# Altium project RK3566.PrjPcb (part 2 of 3)

## Sheet RK3566_POWER.SchDoc
size A3; SheetNumber: 15; SheetTotal: 20
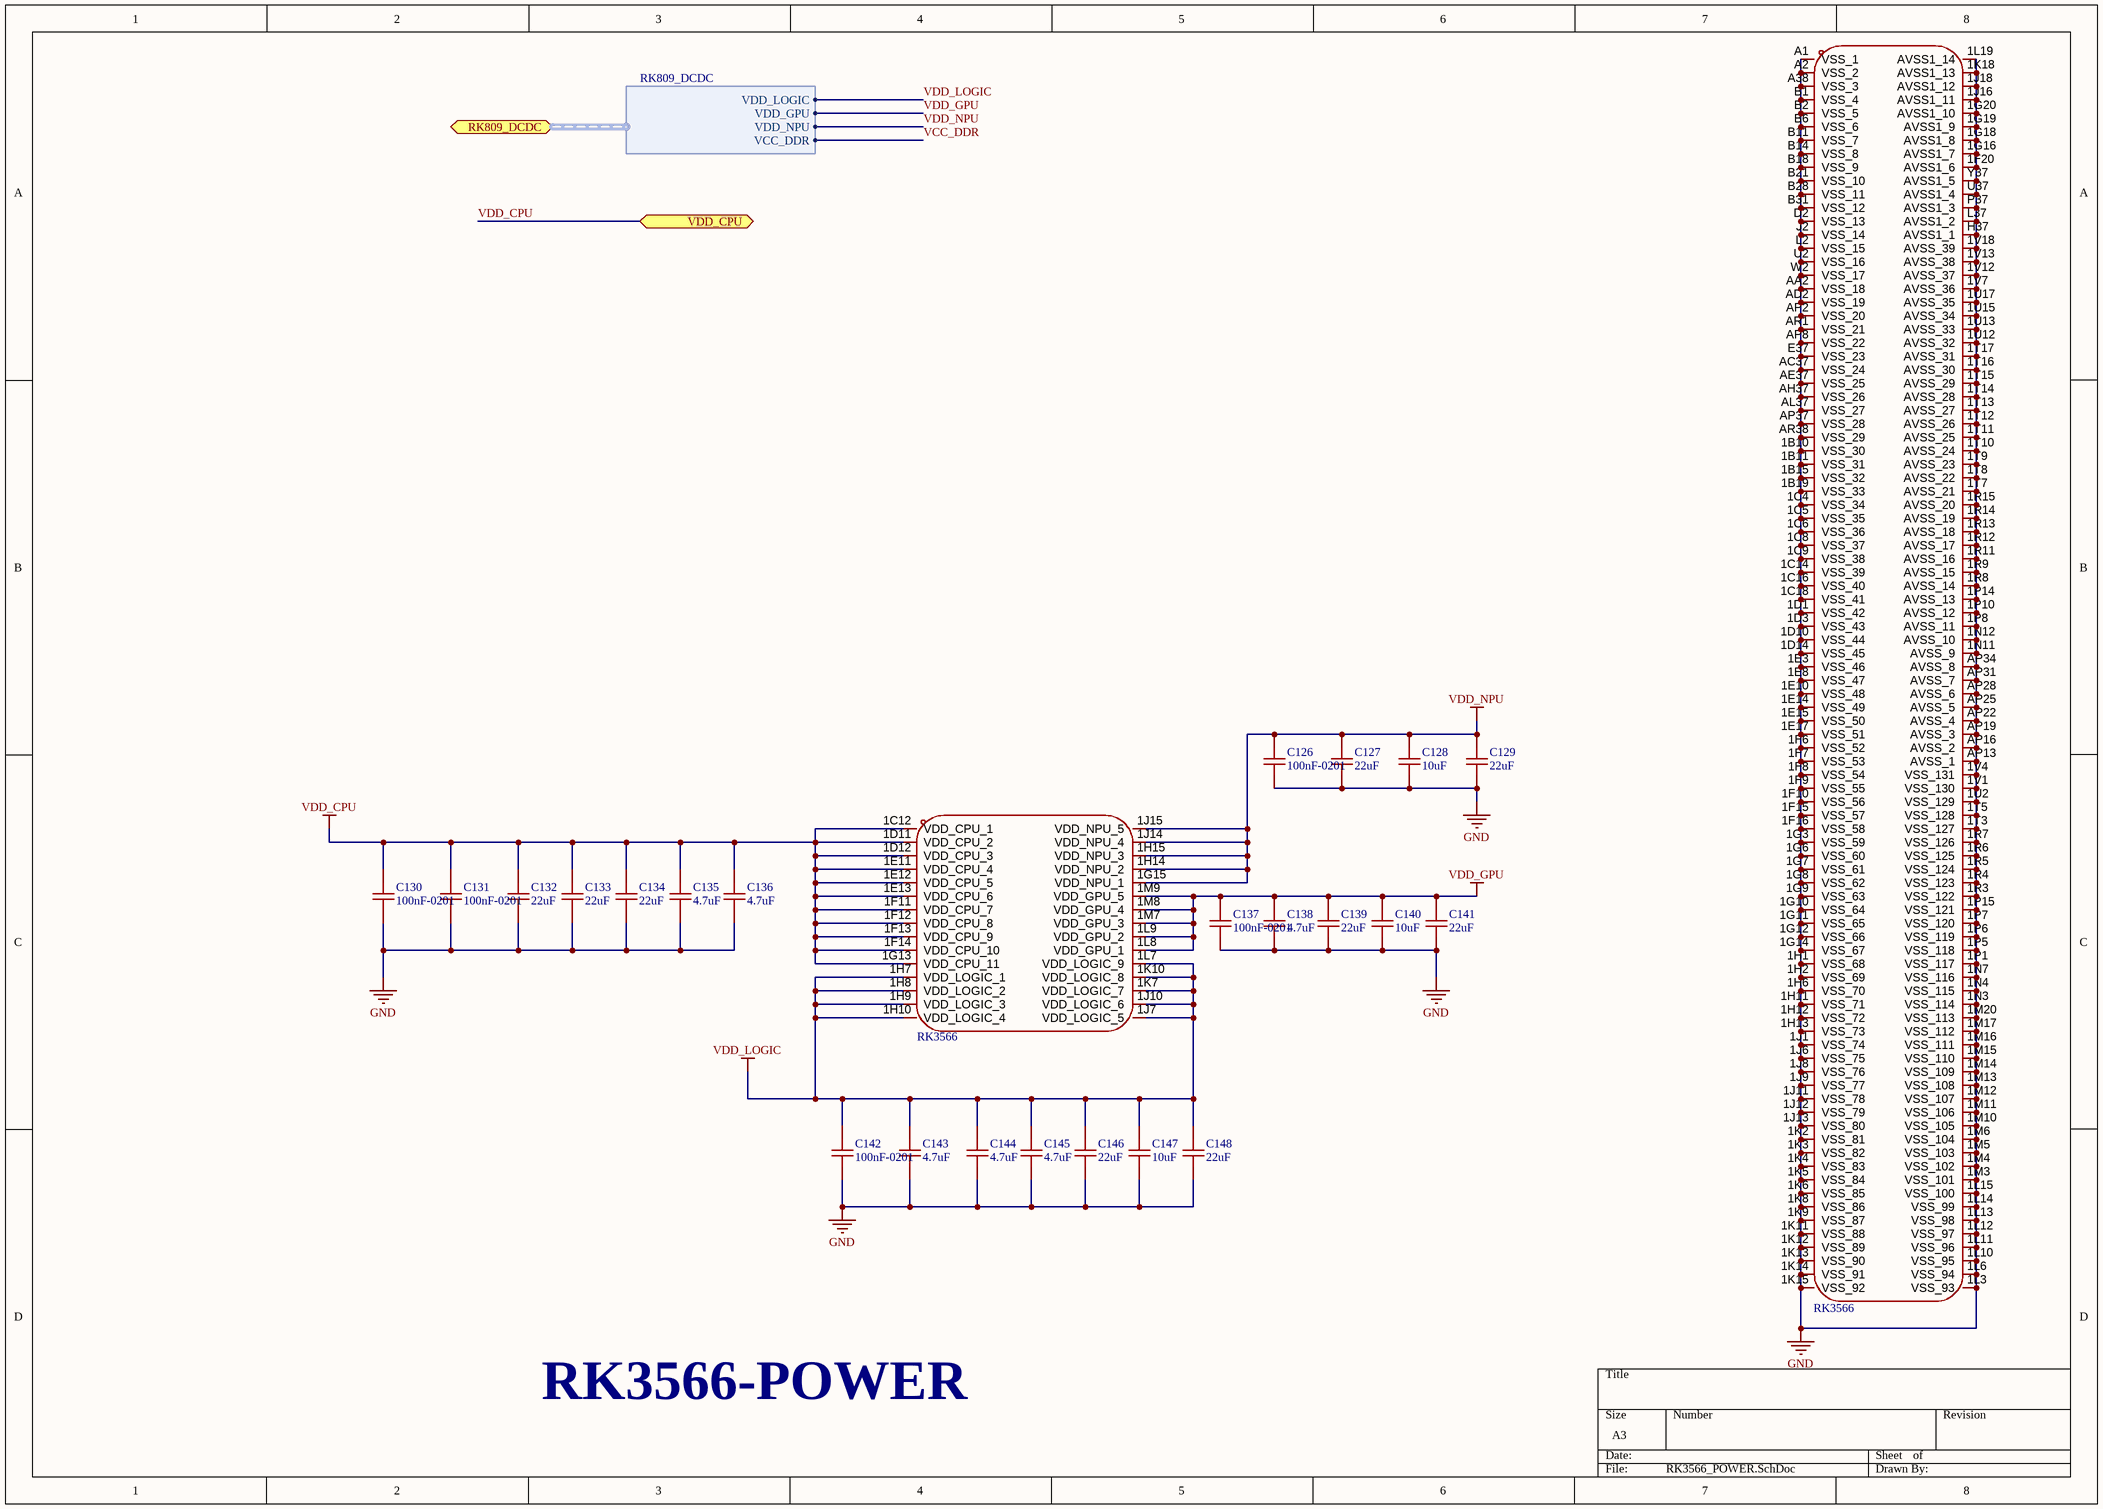
[diagram p7: RK3566_POWER.SchDoc]

### Parts
C126  100nF-0201  [C0201]
C127  22uF  [C0603]
C128  10uF  [C0603]
C129  22uF  [C0603]
C130  100nF-0201  [C0201]
C131  100nF-0201  [C0201]
C132  22uF  [C0603]
C133  22uF  [C0603]
C134  22uF  [C0603]
C135  4.7uF  [C0402]
C136  4.7uF  [C0402]
C137  100nF-0201  [C0201]
C138  4.7uF  [C0402]
C139  22uF  [C0603]
C140  10uF  [C0603]
C141  22uF  [C0603]
C142  100nF-0201  [C0201]
C143  4.7uF  [C0402]
C144  4.7uF  [C0402]
C145  4.7uF  [C0402]
C146  22uF  [C0603]
C147  10uF  [C0603]
C148  22uF  [C0603]
U2  RK3566  [BGA-565_L15.5-W14.4-P0.40_RK3566_1]  (parts A,B of 8)

### Ports
RK809_DCDC (bidir, harness RK809_DCDC, see RK3566[2D], POWER[3D], POWER_PMIC[1A], RK3566[3D]), VDD_CPU (bidir, see RK3566[2D], POWER[5D], POWER_EXTENSION[1A], RK3566[3D])

### Harnesses
RK809_DCDC: VDD_LOGIC, VDD_GPU, VDD_NPU, VCC_DDR

### Nets
GND: C126.1 C127.1 C128.1 C129.1 C130.1 C131.1 C132.1 C133.1 C134.1 C135.1 C136.1 C137.1 C138.1 C139.1 C140.1 C141.1 C142.1 C143.1 C144.1 C145.1 C146.1 C147.1 C148.1 U2.1B10(VSS_30) U2.1B11(VSS_31) U2.1B15(VSS_32) U2.1B19(VSS_33) U2.1C4(VSS_34) U2.1C5(VSS_35) U2.1C6(VSS_36) U2.1C8(VSS_37) U2.1C9(VSS_38) U2.1C14(VSS_39) U2.1C16(VSS_40) U2.1C18(VSS_41) U2.1D1(VSS_42) U2.1D3(VSS_43) U2.1D10(VSS_44) U2.1D14(VSS_45) U2.1E3(VSS_46) U2.1E8(VSS_47) U2.1E10(VSS_48) U2.1E14(VSS_49) U2.1E15(VSS_50) U2.1E17(VSS_51) U2.1F6(VSS_52) U2.1F7(VSS_53) U2.1F8(VSS_54) U2.1F9(VSS_55) U2.1F10(VSS_56) U2.1F15(VSS_57) U2.1F16(VSS_58) U2.1F20(AVSS1_6) U2.1G3(VSS_59) U2.1G6(VSS_60) U2.1G7(VSS_61) U2.1G8(VSS_62) U2.1G9(VSS_63) U2.1G10(VSS_64) U2.1G11(VSS_65) U2.1G12(VSS_66) U2.1G14(VSS_67) U2.1G16(AVSS1_7) U2.1G18(AVSS1_8) U2.1G19(AVSS1_9) U2.1G20(AVSS1_10) U2.1H1(VSS_68) U2.1H2(VSS_69) U2.1H6(VSS_70) U2.1H11(VSS_71) U2.1H12(VSS_72) U2.1H13(VSS_73) U2.1J1(VSS_74) U2.1J6(VSS_75) U2.1J8(VSS_76) U2.1J9(VSS_77) U2.1J11(VSS_78) U2.1J12(VSS_79) U2.1J13(VSS_80) U2.1J16(AVSS1_11) U2.1J18(AVSS1_12) U2.1K2(VSS_81) U2.1K3(VSS_82) U2.1K4(VSS_83) U2.1K5(VSS_84) U2.1K6(VSS_85) U2.1K8(VSS_86) U2.1K9(VSS_87) U2.1K11(VSS_88) U2.1K12(VSS_89) U2.1K13(VSS_90) U2.1K14(VSS_91) U2.1K15(VSS_92) U2.1K18(AVSS1_13) U2.1L3(VSS_93) U2.1L6(VSS_94) U2.1L10(VSS_95) U2.1L11(VSS_96) U2.1L12(VSS_97) U2.1L13(VSS_98) U2.1L14(VSS_99) U2.1L15(VSS_100) U2.1L19(AVSS1_14) U2.1M3(VSS_101) U2.1M4(VSS_102) U2.1M5(VSS_103) U2.1M6(VSS_104) U2.1M10(VSS_105) U2.1M11(VSS_106) U2.1M12(VSS_107) U2.1M13(VSS_108) U2.1M14(VSS_109) U2.1M15(VSS_110) U2.1M16(VSS_111) U2.1M17(VSS_112) U2.1M20(VSS_113) U2.1N3(VSS_114) U2.1N4(VSS_115) U2.1N7(VSS_116) U2.1N11(AVSS_9) U2.1N12(AVSS_10) U2.1P1(VSS_117) U2.1P5(VSS_118) U2.1P6(VSS_119) U2.1P7(VSS_120) U2.1P8(AVSS_11) U2.1P10(AVSS_12) U2.1P14(AVSS_13) U2.1P15(VSS_121) U2.1R3(VSS_122) U2.1R4(VSS_123) U2.1R5(VSS_124) U2.1R6(VSS_125) U2.1R7(VSS_126) U2.1R8(AVSS_14) U2.1R9(AVSS_15) U2.1R11(AVSS_16) U2.1R12(AVSS_17) U2.1R13(AVSS_18) U2.1R14(AVSS_19) U2.1R15(AVSS_20) U2.1T3(VSS_127) U2.1T5(VSS_128) U2.1T7(AVSS_21) U2.1T8(AVSS_22) U2.1T9(AVSS_23) U2.1T10(AVSS_24) U2.1T11(AVSS_25) U2.1T12(AVSS_26) U2.1T13(AVSS_27) U2.1T14(AVSS_28) U2.1T15(AVSS_29) U2.1T16(AVSS_30) U2.1T17(AVSS_31) U2.1U2(VSS_129) U2.1U12(AVSS_32) U2.1U13(AVSS_33) U2.1U15(AVSS_34) U2.1U17(AVSS_35) U2.1V1(VSS_130) U2.1V4(VSS_131) U2.1V7(AVSS_36) U2.1V12(AVSS_37) U2.1V13(AVSS_38) U2.1V18(AVSS_39) U2.A1(VSS_1) U2.A2(VSS_2) U2.A38(VSS_3) U2.AA2(VSS_18) U2.AC37(VSS_24) U2.AD2(VSS_19) U2.AE37(VSS_25) U2.AH37(VSS_26) U2.AL37(VSS_27) U2.AP2(VSS_20) U2.AP8(VSS_22) U2.AP13(AVSS_1) U2.AP16(AVSS_2) U2.AP19(AVSS_3) U2.AP22(AVSS_4) U2.AP25(AVSS_5) U2.AP28(AVSS_6) U2.AP31(AVSS_7) U2.AP34(AVSS_8) U2.AP37(VSS_28) U2.AR1(VSS_21) U2.AR38(VSS_29) U2.B1(VSS_4) U2.B2(VSS_5) U2.B6(VSS_6) U2.B11(VSS_7) U2.B14(VSS_8) U2.B18(VSS_9) U2.B21(VSS_10) U2.B28(VSS_11) U2.B31(VSS_12) U2.D2(VSS_13) U2.E37(VSS_23) U2.H37(AVSS1_1) U2.J2(VSS_14) U2.L2(VSS_15) U2.L37(AVSS1_2) U2.P37(AVSS1_3) U2.U2(VSS_16) U2.U37(AVSS1_4) U2.W2(VSS_17) U2.Y37(AVSS1_5)
VDD_CPU: C130.2 C131.2 C132.2 C133.2 C134.2 C135.2 C136.2 U2.1C12(VDD_CPU_1) U2.1D11(VDD_CPU_2) U2.1D12(VDD_CPU_3) U2.1E11(VDD_CPU_4) U2.1E12(VDD_CPU_5) U2.1E13(VDD_CPU_6) U2.1F11(VDD_CPU_7) U2.1F12(VDD_CPU_8) U2.1F13(VDD_CPU_9) U2.1F14(VDD_CPU_10) U2.1G13(VDD_CPU_11) ; port VDD_CPU
VDD_GPU: C137.2 C138.2 C139.2 C140.2 C141.2 U2.1L8(VDD_GPU_1) U2.1L9(VDD_GPU_2) U2.1M7(VDD_GPU_3) U2.1M8(VDD_GPU_4) U2.1M9(VDD_GPU_5) ; port RK809_DCDC.VDD_GPU
VDD_LOGIC: C142.2 C143.2 C144.2 C145.2 C146.2 C147.2 C148.2 U2.1H7(VDD_LOGIC_1) U2.1H8(VDD_LOGIC_2) U2.1H9(VDD_LOGIC_3) U2.1H10(VDD_LOGIC_4) U2.1J7(VDD_LOGIC_5) U2.1J10(VDD_LOGIC_6) U2.1K7(VDD_LOGIC_7) U2.1K10(VDD_LOGIC_8) U2.1L7(VDD_LOGIC_9) ; port RK809_DCDC.VDD_LOGIC
VDD_NPU: C126.2 C127.2 C128.2 C129.2 U2.1G15(VDD_NPU_1) U2.1H14(VDD_NPU_2) U2.1H15(VDD_NPU_3) U2.1J14(VDD_NPU_4) U2.1J15(VDD_NPU_5) ; port RK809_DCDC.VDD_NPU

### Notes on the sheet
- RK3566-POWER

### Library data of the parts
C126 C130 C131 C137 C142 = 100nF-0201: CL03A104KO3NNNC
C127 C129 C132-C134 C139 C141 C146 C148 = 22uF: 16V 22uF X5R ±20% 0603 Ceramic Capacitors ROHS
C128 C140 C147 = 10uF: 10V 10uF X5R ±10% 0603 Ceramic Capacitors ROHS
C135 C136 C138 C143-C145 = 4.7uF: 10V 4.7uF X5R ±20% 0402 Ceramic Capacitors ROHS
U2 = RK3566: BGA-565(15.5x14.4); Symbol: RK3566

## Sheet LPDDR4.SchDoc
size A3; SheetNumber: 3; SheetTotal: 20
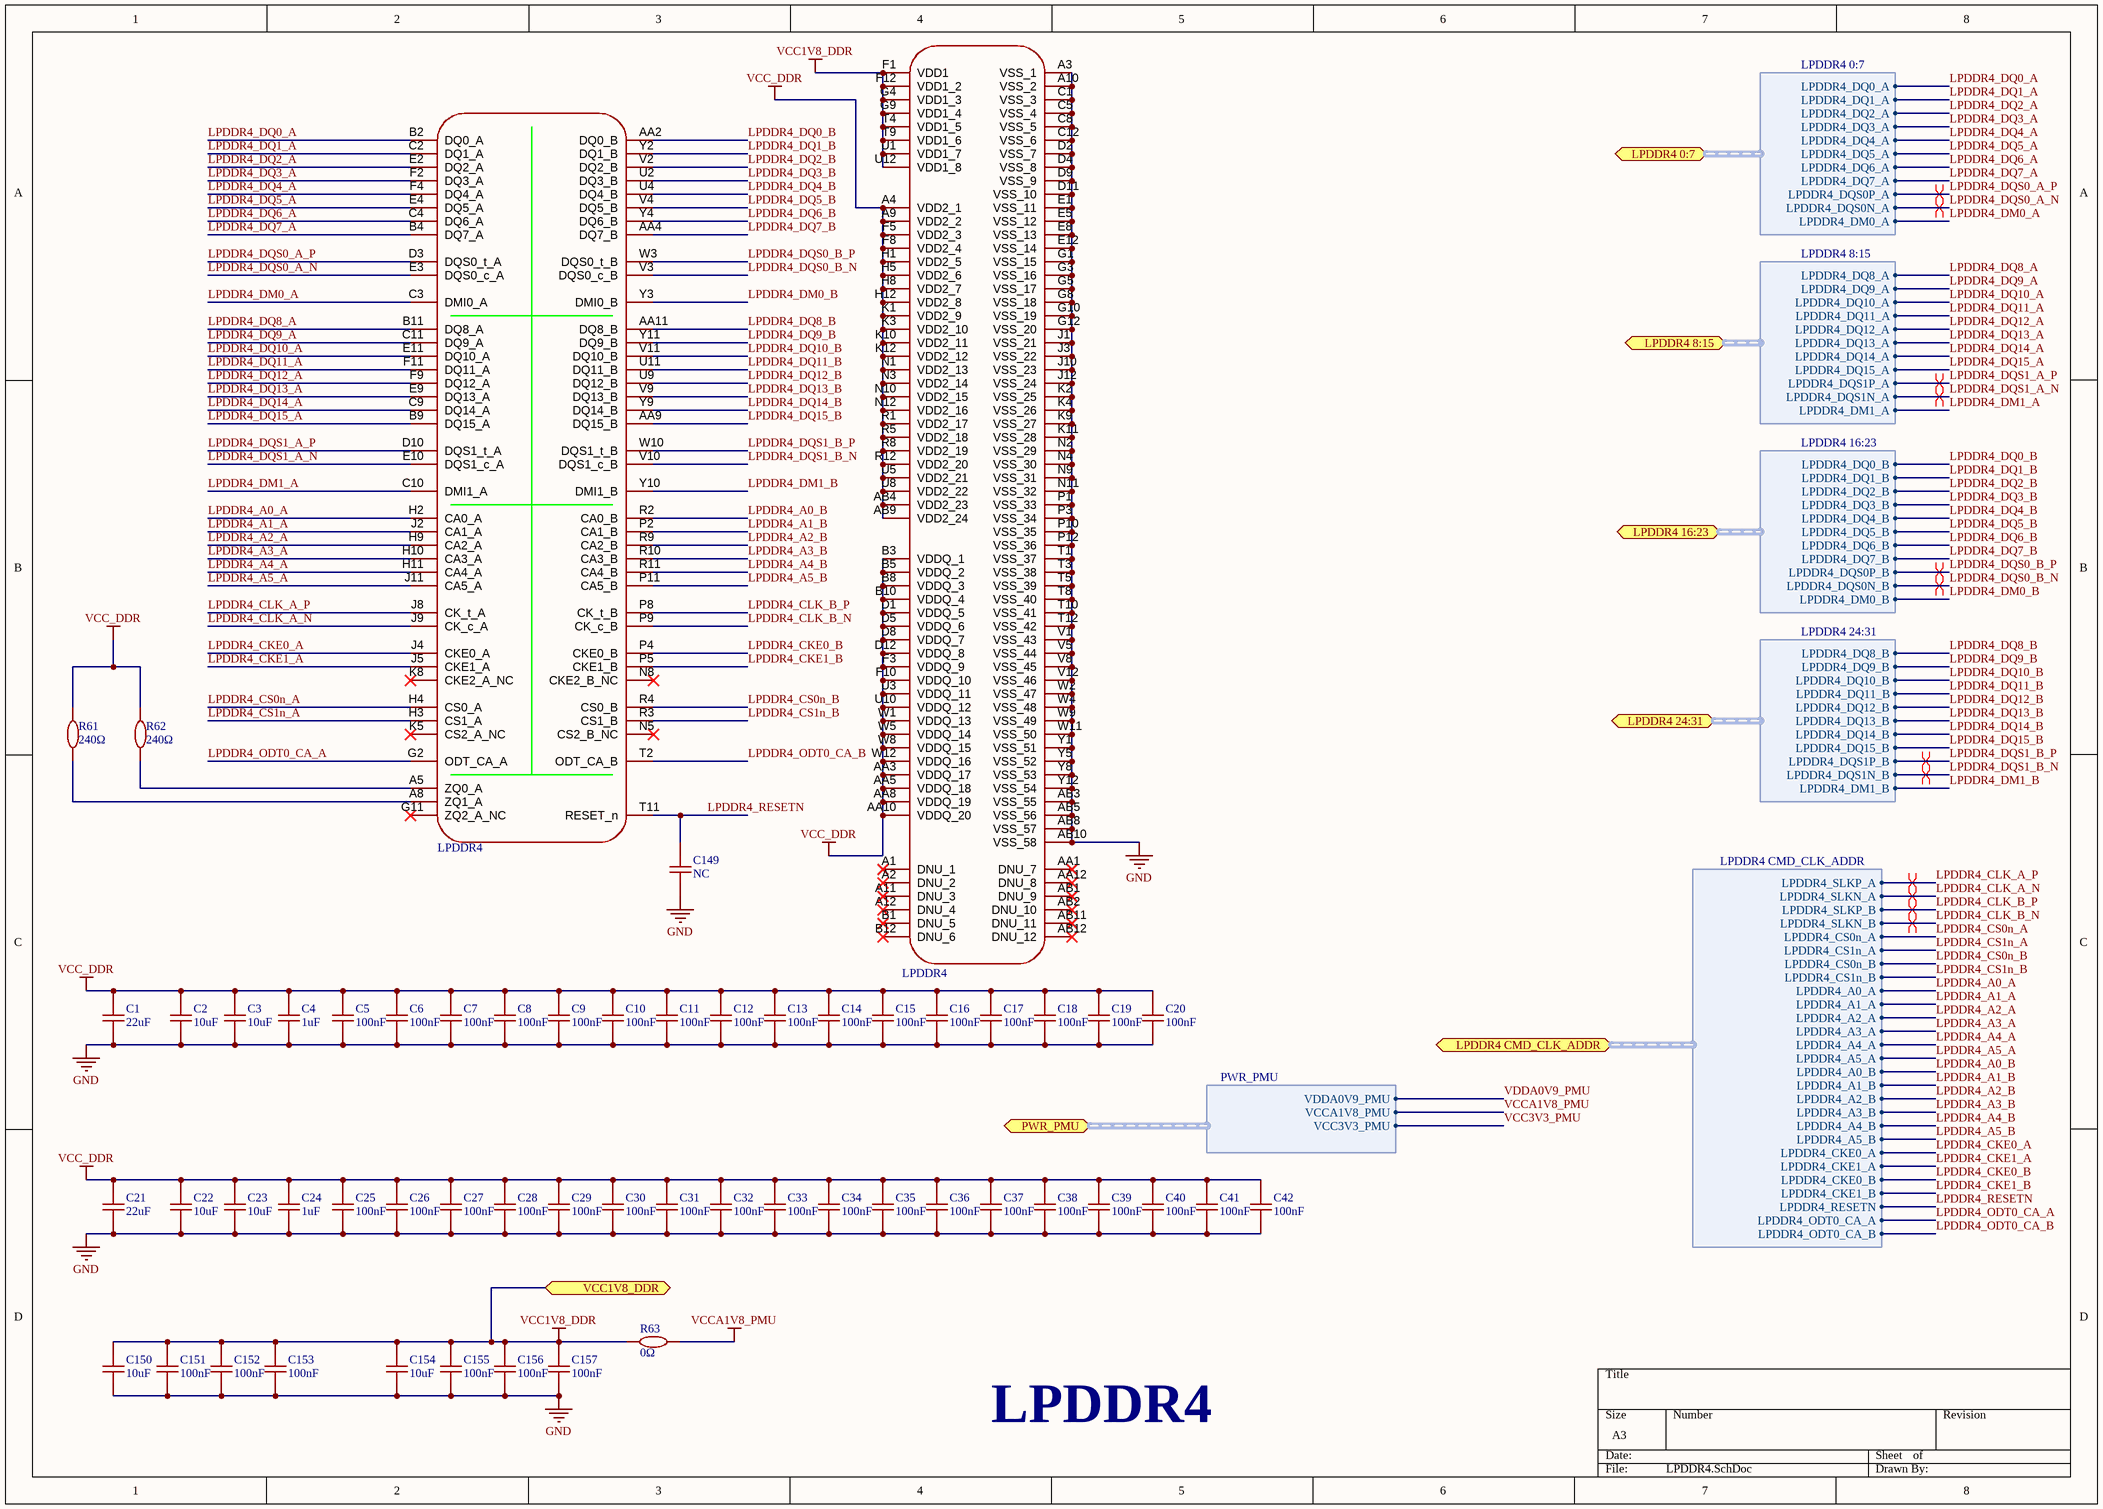
[diagram p8: LPDDR4.SchDoc]

### Parts
C1  22uF  [C0603]
C2  10uF  [C0603]
C3  10uF  [C0603]
C4  1uF  [C0402]
C5  100nF  [C0402]
C6  100nF  [C0402]
C7  100nF  [C0402]
C8  100nF  [C0402]
C9  100nF  [C0402]
C10  100nF  [C0402]
C11  100nF  [C0402]
C12  100nF  [C0402]
C13  100nF  [C0402]
C14  100nF  [C0402]
C15  100nF  [C0402]
C16  100nF  [C0402]
C17  100nF  [C0402]
C18  100nF  [C0402]
C19  100nF  [C0402]
C20  100nF  [C0402]
C21  22uF  [C0603]
C22  10uF  [C0603]
C23  10uF  [C0603]
C24  1uF  [C0402]
C25  100nF  [C0402]
C26  100nF  [C0402]
C27  100nF  [C0402]
C28  100nF  [C0402]
C29  100nF  [C0402]
C30  100nF  [C0402]
C31  100nF  [C0402]
C32  100nF  [C0402]
C33  100nF  [C0402]
C34  100nF  [C0402]
C35  100nF  [C0402]
C36  100nF  [C0402]
C37  100nF  [C0402]
C38  100nF  [C0402]
C39  100nF  [C0402]
C40  100nF  [C0402]
C41  100nF  [C0402]
C42  100nF  [C0402]
C149  NC  [C0402]
C150  10uF  [C0603]
C151  100nF  [C0402]
C152  100nF  [C0402]
C153  100nF  [C0402]
C154  10uF  [C0603]
C155  100nF  [C0402]
C156  100nF  [C0402]
C157  100nF  [C0402]
R61  240Ω  [R0402]
R62  240Ω  [R0402]
R63  0Ω  [R0402]
U1  LPDDR4  [FBGA-200_L15.0-W10.0-BL_H9HCNNNBKUMLXR]  (parts A,B of 2)

### Ports
LPDDR4 0:7 (bidir, harness LPDDR4 0:7, see Overview[6B], RK3566[2A], RK3566_DDR_PHY[3@]), LPDDR4 8:15 (bidir, harness LPDDR4 8:15, see Overview[6B], RK3566[2A], RK3566_DDR_PHY[3@]), LPDDR4 16:23 (bidir, harness LPDDR4 16:23, see Overview[6B], RK3566[2A], RK3566_DDR_PHY[3A]), LPDDR4 24:31 (bidir, harness LPDDR4 24:31, see Overview[6B], RK3566[2A], RK3566_DDR_PHY[3B]), LPDDR4 CMD_CLK_ADDR (bidir, harness LPDDR4 CMD_CLK_ADDR, see Overview[6B], RK3566[2A], RK3566_DDR_PHY[3C]), PWR_PMU (bidir, harness PWR_PMU, see Overview[7B], POWER[2D], POWER_PMIC[4D], RK3566[3C], RK3566_OSC_PLL_PMUO1_2[1A]), VCC1V8_DDR (bidir)

### Harnesses
LPDDR4 0:7: LPDDR4_DQ0_A, LPDDR4_DQ1_A, LPDDR4_DQ2_A, LPDDR4_DQ3_A, LPDDR4_DQ4_A, LPDDR4_DQ5_A, LPDDR4_DQ6_A, LPDDR4_DQ7_A, LPDDR4_DQS0P_A, LPDDR4_DQS0N_A, LPDDR4_DM0_A
LPDDR4 8:15: LPDDR4_DQ8_A, LPDDR4_DQ9_A, LPDDR4_DQ10_A, LPDDR4_DQ11_A, LPDDR4_DQ12_A, LPDDR4_DQ13_A, LPDDR4_DQ14_A, LPDDR4_DQ15_A, LPDDR4_DQS1P_A, LPDDR4_DQS1N_A, LPDDR4_DM1_A
LPDDR4 16:23: LPDDR4_DQ0_B, LPDDR4_DQ1_B, LPDDR4_DQ2_B, LPDDR4_DQ3_B, LPDDR4_DQ4_B, LPDDR4_DQ5_B, LPDDR4_DQ6_B, LPDDR4_DQ7_B, LPDDR4_DQS0P_B, LPDDR4_DQS0N_B, LPDDR4_DM0_B
LPDDR4 24:31: LPDDR4_DQ8_B, LPDDR4_DQ9_B, LPDDR4_DQ10_B, LPDDR4_DQ11_B, LPDDR4_DQ12_B, LPDDR4_DQ13_B, LPDDR4_DQ14_B, LPDDR4_DQ15_B, LPDDR4_DQS1P_B, LPDDR4_DQS1N_B, LPDDR4_DM1_B
LPDDR4 CMD_CLK_ADDR: LPDDR4_SLKP_A, LPDDR4_SLKN_A, LPDDR4_SLKP_B, LPDDR4_SLKN_B, LPDDR4_CS0n_A, LPDDR4_CS1n_A, LPDDR4_CS0n_B, LPDDR4_CS1n_B, LPDDR4_A0_A, LPDDR4_A1_A, LPDDR4_A2_A, LPDDR4_A3_A, LPDDR4_A4_A, LPDDR4_A5_A, LPDDR4_A0_B, LPDDR4_A1_B, LPDDR4_A2_B, LPDDR4_A3_B, LPDDR4_A4_B, LPDDR4_A5_B, LPDDR4_CKE0_A, LPDDR4_CKE1_A, LPDDR4_CKE0_B, LPDDR4_CKE1_B, LPDDR4_RESETN, LPDDR4_ODT0_CA_A, LPDDR4_ODT0_CA_B
PWR_PMU: VCCA1V8_PMU, VDDA0V9_PMU, VCC3V3_PMU

### Nets
GND: C1.1 C2.1 C3.1 C4.1 C5.1 C6.1 C7.1 C8.1 C9.1 C10.1 C11.1 C12.1 C13.1 C14.1 C15.1 C16.1 C17.1 C18.1 C19.1 C20.1 C21.1 C22.1 C23.1 C24.1 C25.1 C26.1 C27.1 C28.1 C29.1 C30.1 C31.1 C32.1 C33.1 C34.1 C35.1 C36.1 C37.1 C38.1 C39.1 C40.1 C41.1 C42.1 C149.1 C150.1 C151.1 C152.1 C153.1 C154.1 C155.1 C156.1 C157.1 U1.A3(VSS_1) U1.A10(VSS_2) U1.AB3(VSS_55) U1.AB5(VSS_56) U1.AB8(VSS_57) U1.AB10(VSS_58) U1.C1(VSS_3) U1.C5(VSS_4) U1.C8(VSS_5) U1.C12(VSS_6) U1.D2(VSS_7) U1.D4(VSS_8) U1.D9(VSS_9) U1.D11(VSS_10) U1.E1(VSS_11) U1.E5(VSS_12) U1.E8(VSS_13) U1.E12(VSS_14) U1.G1(VSS_15) U1.G3(VSS_16) U1.G5(VSS_17) U1.G8(VSS_18) U1.G10(VSS_19) U1.G12(VSS_20) U1.J1(VSS_21) U1.J3(VSS_22) U1.J10(VSS_23) U1.J12(VSS_24) U1.K2(VSS_25) U1.K4(VSS_26) U1.K9(VSS_27) U1.K11(VSS_28) U1.N2(VSS_29) U1.N4(VSS_30) U1.N9(VSS_31) U1.N11(VSS_32) U1.P1(VSS_33) U1.P3(VSS_34) U1.P10(VSS_35) U1.P12(VSS_36) U1.T1(VSS_37) U1.T3(VSS_38) U1.T5(VSS_39) U1.T8(VSS_40) U1.T10(VSS_41) U1.T12(VSS_42) U1.V1(VSS_43) U1.V5(VSS_44) U1.V8(VSS_45) U1.V12(VSS_46) U1.W2(VSS_47) U1.W4(VSS_48) U1.W9(VSS_49) U1.W11(VSS_50) U1.Y1(VSS_51) U1.Y5(VSS_52) U1.Y8(VSS_53) U1.Y12(VSS_54)
VCC1V8_DDR: C150.2 C151.2 C152.2 C153.2 C154.2 C155.2 C156.2 C157.2 R63.1 U1.F1(VDD1) U1.F12(VDD1_2) U1.G4(VDD1_3) U1.G9(VDD1_4) U1.T4(VDD1_5) U1.T9(VDD1_6) U1.U1(VDD1_7) U1.U12(VDD1_8) ; port VCC1V8_DDR
VCC_DDR: C1.2 C2.2 C3.2 C4.2 C5.2 C6.2 C7.2 C8.2 C9.2 C10.2 C11.2 C12.2 C13.2 C14.2 C15.2 C16.2 C17.2 C18.2 C19.2 C20.2 C21.2 C22.2 C23.2 C24.2 C25.2 C26.2 C27.2 C28.2 C29.2 C30.2 C31.2 C32.2 C33.2 C34.2 C35.2 C36.2 C37.2 C38.2 C39.2 C40.2 C41.2 C42.2 R61.2 R62.2 U1.A4(VDD2_1) U1.A9(VDD2_2) U1.AA3(VDDQ_17) U1.AA5(VDDQ_18) U1.AA8(VDDQ_19) U1.AA10(VDDQ_20) U1.AB4(VDD2_23) U1.AB9(VDD2_24) U1.B3(VDDQ_1) U1.B5(VDDQ_2) U1.B8(VDDQ_3) U1.B10(VDDQ_4) U1.D1(VDDQ_5) U1.D5(VDDQ_6) U1.D8(VDDQ_7) U1.D12(VDDQ_8) U1.F3(VDDQ_9) U1.F5(VDD2_3) U1.F8(VDD2_4) U1.F10(VDDQ_10) U1.H1(VDD2_5) U1.H5(VDD2_6) U1.H8(VDD2_7) U1.H12(VDD2_8) U1.K1(VDD2_9) U1.K3(VDD2_10) U1.K10(VDD2_11) U1.K12(VDD2_12) U1.N1(VDD2_13) U1.N3(VDD2_14) U1.N10(VDD2_15) U1.N12(VDD2_16) U1.R1(VDD2_17) U1.R5(VDD2_18) U1.R8(VDD2_19) U1.R12(VDD2_20) U1.U3(VDDQ_11) U1.U5(VDD2_21) U1.U8(VDD2_22) U1.U10(VDDQ_12) U1.W1(VDDQ_13) U1.W5(VDDQ_14) U1.W8(VDDQ_15) U1.W12(VDDQ_16)
VCCA1V8_PMU: R63.2 ; port PWR_PMU.VCCA1V8_PMU
LPDDR4_A0_A: U1.H2(CA0_A) ; port LPDDR4 CMD_CLK_ADDR.LPDDR4_A0_A
LPDDR4_A0_B: U1.R2(CA0_B) ; port LPDDR4 CMD_CLK_ADDR.LPDDR4_A0_B
LPDDR4_A1_A: U1.J2(CA1_A) ; port LPDDR4 CMD_CLK_ADDR.LPDDR4_A1_A
LPDDR4_A1_B: U1.P2(CA1_B) ; port LPDDR4 CMD_CLK_ADDR.LPDDR4_A1_B
LPDDR4_A2_A: U1.H9(CA2_A) ; port LPDDR4 CMD_CLK_ADDR.LPDDR4_A2_A
LPDDR4_A2_B: U1.R9(CA2_B) ; port LPDDR4 CMD_CLK_ADDR.LPDDR4_A2_B
LPDDR4_A3_A: U1.H10(CA3_A) ; port LPDDR4 CMD_CLK_ADDR.LPDDR4_A3_A
LPDDR4_A3_B: U1.R10(CA3_B) ; port LPDDR4 CMD_CLK_ADDR.LPDDR4_A3_B
LPDDR4_A4_A: U1.H11(CA4_A) ; port LPDDR4 CMD_CLK_ADDR.LPDDR4_A4_A
LPDDR4_A4_B: U1.R11(CA4_B) ; port LPDDR4 CMD_CLK_ADDR.LPDDR4_A4_B
LPDDR4_A5_A: U1.J11(CA5_A) ; port LPDDR4 CMD_CLK_ADDR.LPDDR4_A5_A
LPDDR4_A5_B: U1.P11(CA5_B) ; port LPDDR4 CMD_CLK_ADDR.LPDDR4_A5_B
LPDDR4_CKE0_A: U1.J4(CKE0_A) ; port LPDDR4 CMD_CLK_ADDR.LPDDR4_CKE0_A
LPDDR4_CKE0_B: U1.P4(CKE0_B) ; port LPDDR4 CMD_CLK_ADDR.LPDDR4_CKE0_B
LPDDR4_CKE1_A: U1.J5(CKE1_A) ; port LPDDR4 CMD_CLK_ADDR.LPDDR4_CKE1_A
LPDDR4_CKE1_B: U1.P5(CKE1_B) ; port LPDDR4 CMD_CLK_ADDR.LPDDR4_CKE1_B
LPDDR4_CLK_A_N: U1.J9(CK_c_A) ; port LPDDR4 CMD_CLK_ADDR.LPDDR4_SLKN_A
LPDDR4_CLK_A_P: U1.J8(CK_t_A) ; port LPDDR4 CMD_CLK_ADDR.LPDDR4_SLKP_A
LPDDR4_CLK_B_N: U1.P9(CK_c_B) ; port LPDDR4 CMD_CLK_ADDR.LPDDR4_SLKN_B
LPDDR4_CLK_B_P: U1.P8(CK_t_B) ; port LPDDR4 CMD_CLK_ADDR.LPDDR4_SLKP_B
LPDDR4_CS0n_A: U1.H4(CS0_A) ; port LPDDR4 CMD_CLK_ADDR.LPDDR4_CS0n_A
LPDDR4_CS0n_B: U1.R4(CS0_B) ; port LPDDR4 CMD_CLK_ADDR.LPDDR4_CS0n_B
LPDDR4_CS1n_A: U1.H3(CS1_A) ; port LPDDR4 CMD_CLK_ADDR.LPDDR4_CS1n_A
LPDDR4_CS1n_B: U1.R3(CS1_B) ; port LPDDR4 CMD_CLK_ADDR.LPDDR4_CS1n_B
LPDDR4_DM0_A: U1.C3(DMI0_A) ; port LPDDR4 0:7.LPDDR4_DM0_A
LPDDR4_DM0_B: U1.Y3(DMI0_B) ; port LPDDR4 16:23.LPDDR4_DM0_B
LPDDR4_DM1_A: U1.C10(DMI1_A) ; port LPDDR4 8:15.LPDDR4_DM1_A
LPDDR4_DM1_B: U1.Y10(DMI1_B) ; port LPDDR4 24:31.LPDDR4_DM1_B
LPDDR4_DQ0_A: U1.B2(DQ0_A) ; port LPDDR4 0:7.LPDDR4_DQ0_A
LPDDR4_DQ0_B: U1.AA2(DQ0_B) ; port LPDDR4 16:23.LPDDR4_DQ0_B
LPDDR4_DQ1_A: U1.C2(DQ1_A) ; port LPDDR4 0:7.LPDDR4_DQ1_A
LPDDR4_DQ1_B: U1.Y2(DQ1_B) ; port LPDDR4 16:23.LPDDR4_DQ1_B
LPDDR4_DQ2_A: U1.E2(DQ2_A) ; port LPDDR4 0:7.LPDDR4_DQ2_A
LPDDR4_DQ2_B: U1.V2(DQ2_B) ; port LPDDR4 16:23.LPDDR4_DQ2_B
LPDDR4_DQ3_A: U1.F2(DQ3_A) ; port LPDDR4 0:7.LPDDR4_DQ3_A
LPDDR4_DQ3_B: U1.U2(DQ3_B) ; port LPDDR4 16:23.LPDDR4_DQ3_B
LPDDR4_DQ4_A: U1.F4(DQ4_A) ; port LPDDR4 0:7.LPDDR4_DQ4_A
LPDDR4_DQ4_B: U1.U4(DQ4_B) ; port LPDDR4 16:23.LPDDR4_DQ4_B
LPDDR4_DQ5_A: U1.E4(DQ5_A) ; port LPDDR4 0:7.LPDDR4_DQ5_A
LPDDR4_DQ5_B: U1.V4(DQ5_B) ; port LPDDR4 16:23.LPDDR4_DQ5_B
LPDDR4_DQ6_A: U1.C4(DQ6_A) ; port LPDDR4 0:7.LPDDR4_DQ6_A
LPDDR4_DQ6_B: U1.Y4(DQ6_B) ; port LPDDR4 16:23.LPDDR4_DQ6_B
LPDDR4_DQ7_A: U1.B4(DQ7_A) ; port LPDDR4 0:7.LPDDR4_DQ7_A
LPDDR4_DQ7_B: U1.AA4(DQ7_B) ; port LPDDR4 16:23.LPDDR4_DQ7_B
LPDDR4_DQ8_A: U1.B11(DQ8_A) ; port LPDDR4 8:15.LPDDR4_DQ8_A
LPDDR4_DQ8_B: U1.AA11(DQ8_B) ; port LPDDR4 24:31.LPDDR4_DQ8_B
LPDDR4_DQ9_A: U1.C11(DQ9_A) ; port LPDDR4 8:15.LPDDR4_DQ9_A
LPDDR4_DQ9_B: U1.Y11(DQ9_B) ; port LPDDR4 24:31.LPDDR4_DQ9_B
LPDDR4_DQ10_A: U1.E11(DQ10_A) ; port LPDDR4 8:15.LPDDR4_DQ10_A
LPDDR4_DQ10_B: U1.V11(DQ10_B) ; port LPDDR4 24:31.LPDDR4_DQ10_B
LPDDR4_DQ11_A: U1.F11(DQ11_A) ; port LPDDR4 8:15.LPDDR4_DQ11_A
LPDDR4_DQ11_B: U1.U11(DQ11_B) ; port LPDDR4 24:31.LPDDR4_DQ11_B
LPDDR4_DQ12_A: U1.F9(DQ12_A) ; port LPDDR4 8:15.LPDDR4_DQ12_A
LPDDR4_DQ12_B: U1.U9(DQ12_B) ; port LPDDR4 24:31.LPDDR4_DQ12_B
LPDDR4_DQ13_A: U1.E9(DQ13_A) ; port LPDDR4 8:15.LPDDR4_DQ13_A
LPDDR4_DQ13_B: U1.V9(DQ13_B) ; port LPDDR4 24:31.LPDDR4_DQ13_B
LPDDR4_DQ14_A: U1.C9(DQ14_A) ; port LPDDR4 8:15.LPDDR4_DQ14_A
LPDDR4_DQ14_B: U1.Y9(DQ14_B) ; port LPDDR4 24:31.LPDDR4_DQ14_B
LPDDR4_DQ15_A: U1.B9(DQ15_A) ; port LPDDR4 8:15.LPDDR4_DQ15_A
LPDDR4_DQ15_B: U1.AA9(DQ15_B) ; port LPDDR4 24:31.LPDDR4_DQ15_B
LPDDR4_DQS0_A_N: U1.E3(DQS0_c_A) ; port LPDDR4 0:7.LPDDR4_DQS0N_A
LPDDR4_DQS0_A_P: U1.D3(DQS0_t_A) ; port LPDDR4 0:7.LPDDR4_DQS0P_A
LPDDR4_DQS0_B_N: U1.V3(DQS0_c_B) ; port LPDDR4 16:23.LPDDR4_DQS0N_B
LPDDR4_DQS0_B_P: U1.W3(DQS0_t_B) ; port LPDDR4 16:23.LPDDR4_DQS0P_B
LPDDR4_DQS1_A_N: U1.E10(DQS1_c_A) ; port LPDDR4 8:15.LPDDR4_DQS1N_A
LPDDR4_DQS1_A_P: U1.D10(DQS1_t_A) ; port LPDDR4 8:15.LPDDR4_DQS1P_A
LPDDR4_DQS1_B_N: U1.V10(DQS1_c_B) ; port LPDDR4 24:31.LPDDR4_DQS1N_B
LPDDR4_DQS1_B_P: U1.W10(DQS1_t_B) ; port LPDDR4 24:31.LPDDR4_DQS1P_B
LPDDR4_ODT0_CA_A: U1.G2(ODT_CA_A) ; port LPDDR4 CMD_CLK_ADDR.LPDDR4_ODT0_CA_A
LPDDR4_ODT0_CA_B: U1.T2(ODT_CA_B) ; port LPDDR4 CMD_CLK_ADDR.LPDDR4_ODT0_CA_B
LPDDR4_RESETN: C149.2 U1.T11(RESET_n) ; port LPDDR4 CMD_CLK_ADDR.LPDDR4_RESETN
NetR61_1: R61.1 U1.A8(ZQ1_A)
NetR62_1: R62.1 U1.A5(ZQ0_A)

Not connected (* = marked no-connect by the designer): U1 A1(DNU_1)* A2(DNU_2)* A11(DNU_3)* A12(DNU_4)* AA1(DNU_7)* AA12(DNU_8)* AB1(DNU_9)* AB2(DNU_10)* AB11(DNU_11)* AB12(DNU_12)* B1(DNU_5)* B12(DNU_6)* G11(ZQ2_A_NC)* K5(CS2_A_NC)* K8(CKE2_A_NC)* N5(CS2_B_NC)* N8(CKE2_B_NC)*

### Layout directives
differential pair: LPDDR4_CLK_A_N, LPDDR4_CLK_A_P, LPDDR4_CLK_B_N, LPDDR4_CLK_B_P, LPDDR4_DQS0_A_N, LPDDR4_DQS0_A_P, LPDDR4_DQS0_B_N, LPDDR4_DQS0_B_P, LPDDR4_DQS1_A_N, LPDDR4_DQS1_A_P, LPDDR4_DQS1_B_N, LPDDR4_DQS1_B_P

### Notes on the sheet
- LPDDR4

### Library data of the parts
C1 C21 = 22uF: as C127 on sheet RK3566_POWER
C2 C3 C22 C23 C150 C154 = 10uF: as C128 on sheet RK3566_POWER
C4 C24 = 1uF: 50V 1uF X5R ±10% 0402 Ceramic Capacitors ROHS
C5-C20 C25-C42 C151-C153 C155-C157 = 100nF: 50V 100nF X7R ±10% 0402 Ceramic Capacitors ROHS
C149 = 10nF: 50V 10nF X7R ±10% 0402 Ceramic Capacitors ROHS
R61 R62 = 240Ω: 240Ω 62.5mW 50V ±100ppm/℃ Thick Film Resistor ±1% 0402 Chip Resistor - Surface Mount ROHS
R63 = 0Ω: 0Ω 62.5mW 50V Thick Film Resistor ±1% 0402 Chip Resistor - Surface Mount ROHS
U1 = LPDDR4: LPDDR4 - SDRAM是一种高速同步DRAM器件，内部配置有1个或2个通道。单通道由8个存储体组成，每通道密度为1 Gb至16 Gb。双通道由8个存储体组成，每通道密度为2 Gb至32 Gb; Symbol: H9HCNNNBKUMLXR-NEE

## Sheet EMMC_SD.SchDoc
size A3; SheetNumber: 6; SheetTotal: 20
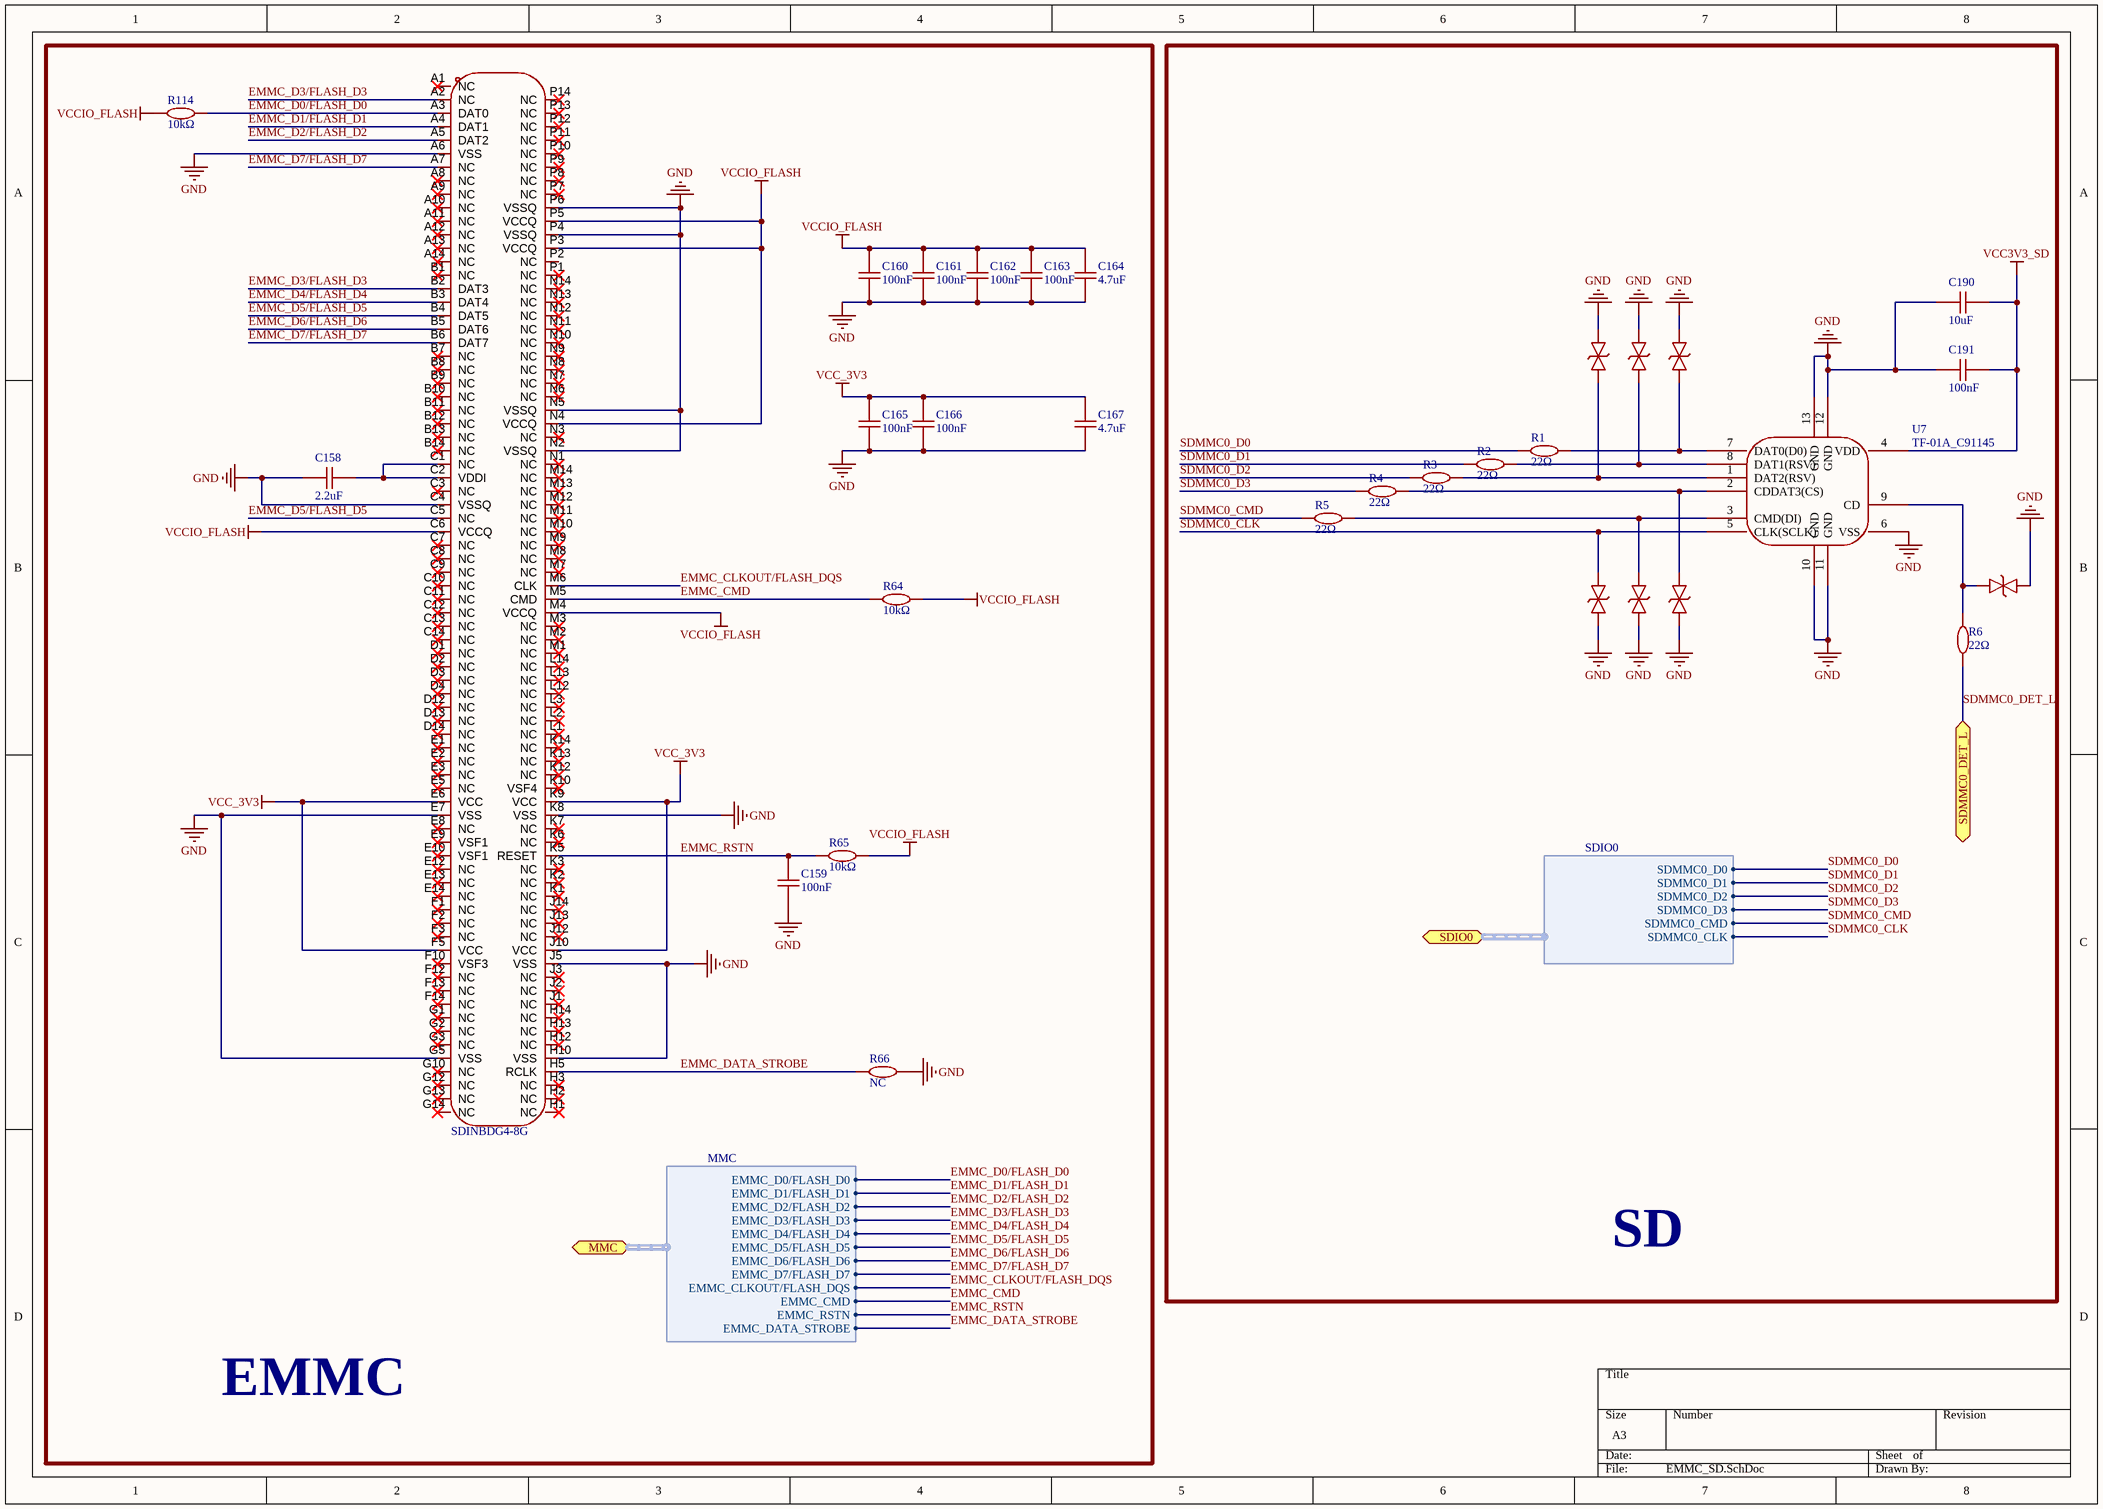
[diagram p9: EMMC_SD.SchDoc]

### Parts
C158  2.2uF  [C0402]
C159  100nF  [C0402]
C160  100nF  [C0402]
C161  100nF  [C0402]
C162  100nF  [C0402]
C163  100nF  [C0402]
C164  4.7uF  [C0402]
C165  100nF  [C0402]
C166  100nF  [C0402]
C167  4.7uF  [C0402]
C190  10uF  [C0603]
C191  100nF  [C0402]
R1  22Ω  [R0402]
R2  22Ω  [R0402]
R3  22Ω  [R0402]
R4  22Ω  [R0402]
R5  22Ω  [R0402]
R6  22Ω  [R0402]
R64  10kΩ  [R0402]
R65  10kΩ  [R0402]
R66  NC  [R0402]
R114  10kΩ  [R0402]
U3  SDINBDG4-8G  [FBGA-153_L13.0-W11.5-P0.50_KLMAG1JETD-B041]
U4  ESD5451N  [DFN1006-2L-BI]  (value not drawn)
U5  ESD5451N  [DFN1006-2L-BI]  (value not drawn)
U6  ESD5451N  [DFN1006-2L-BI]  (value not drawn)
U7  TF-01A_C91145  [TF-SMD_TF-01A]
U8  ESD5451N  [DFN1006-2L-BI]  (value not drawn)
U9  ESD5451N  [DFN1006-2L-BI]  (value not drawn)
U10  ESD5451N  [DFN1006-2L-BI]  (value not drawn)
U11  ESD5451N  [DFN1006-2L-BI]  (value not drawn)

### Blocks framed on the sheet
EMMC: C158-C167 R64-R66 R114 U3
SD: C190 C191 R1-R6 U4-U11

### Ports
MMC (bidir, harness MMC, see Overview[6B], RK3566[3B], RK3566_FLASH_SD_SARADC[1A]), SDIO0 (bidir, harness SDIO0, see Overview[6C], RK3566[3B], RK3566_FLASH_SD_SARADC[4A]), SDMMC0_DET_L (bidir, see Overview[6C], RK3566[3C], RK3566_OSC_PLL_PMUO1_2[3D])

### Harnesses
MMC: EMMC_D0/FLASH_D0, EMMC_D1/FLASH_D1, EMMC_D2/FLASH_D2, EMMC_D3/FLASH_D3, EMMC_D4/FLASH_D4, EMMC_D5/FLASH_D5, EMMC_D6/FLASH_D6, EMMC_D7/FLASH_D7, EMMC_CLKOUT/FLASH_DQS, EMMC_CMD, EMMC_RSTN, EMMC_DATA_STROBE
SDIO0: SDMMC0_D0, SDMMC0_D1, SDMMC0_D2, SDMMC0_D3, SDMMC0_CMD, SDMMC0_CLK

### Nets
GND: C158.1 C159.1 C160.1 C161.1 C162.1 C163.1 C164.1 C165.1 C166.1 C167.1 C190.1 C191.1 R66.2 U3.A6(VSS) U3.C4(VSSQ) U3.E7(VSS) U3.G5(VSS) U3.H10(VSS) U3.J5(VSS) U3.K8(VSS) U3.N2(VSSQ) U3.N5(VSSQ) U3.P4(VSSQ) U3.P6(VSSQ) U4.2 U5.2 U6.2 U7.6(VSS) U7.10(GND) U7.11(GND) U7.12(GND) U7.13(GND) U8.1 U9.1 U10.1 U11.1
VCC3V3_SD: C190.2 C191.2 U7.4(VDD)
VCC_3V3: C165.2 C166.2 C167.2 U3.E6(VCC) U3.F5(VCC) U3.J10(VCC) U3.K9(VCC)
VCCIO_FLASH: C160.2 C161.2 C162.2 C163.2 C164.2 R64.2 R65.2 R114.1 U3.C6(VCCQ) U3.M4(VCCQ) U3.N4(VCCQ) U3.P3(VCCQ) U3.P5(VCCQ)
EMMC_CLKOUT/FLASH_DQS: U3.M6(CLK) ; port MMC.EMMC_CLKOUT/FLASH_DQS
EMMC_CMD: R64.1 U3.M5(CMD) ; port MMC.EMMC_CMD
EMMC_D0/FLASH_D0: R114.2 U3.A3(DAT0) ; port MMC.EMMC_D0/FLASH_D0
EMMC_D1/FLASH_D1: U3.A4(DAT1) ; port MMC.EMMC_D1/FLASH_D1
EMMC_D2/FLASH_D2: U3.A5(DAT2) ; port MMC.EMMC_D2/FLASH_D2
EMMC_D3/FLASH_D3: U3.A2(NC) U3.B2(DAT3) ; port MMC.EMMC_D3/FLASH_D3
EMMC_D4/FLASH_D4: U3.B3(DAT4) ; port MMC.EMMC_D4/FLASH_D4
EMMC_D5/FLASH_D5: U3.B4(DAT5) U3.C5(NC) ; port MMC.EMMC_D5/FLASH_D5
EMMC_D6/FLASH_D6: U3.B5(DAT6) ; port MMC.EMMC_D6/FLASH_D6
EMMC_D7/FLASH_D7: U3.A7(NC) U3.B6(DAT7) ; port MMC.EMMC_D7/FLASH_D7
EMMC_DATA_STROBE: R66.1 U3.H5(RCLK) ; port MMC.EMMC_DATA_STROBE
EMMC_RSTN: C159.2 R65.1 U3.K5(RESET) ; port MMC.EMMC_RSTN
SDMMC0_CLK: U7.5(CLK(SCLK)) U8.2 ; port SDIO0.SDMMC0_CLK
SDMMC0_CMD: R5.1 ; port SDIO0.SDMMC0_CMD
SDMMC0_D0: R1.1 ; port SDIO0.SDMMC0_D0
SDMMC0_D1: R2.1 ; port SDIO0.SDMMC0_D1
SDMMC0_D2: R3.1 ; port SDIO0.SDMMC0_D2
SDMMC0_D3: R4.1 ; port SDIO0.SDMMC0_D3
SDMMC0_DET_L: R6.1 ; port SDMMC0_DET_L
NetC158_2: C158.2 U3.C1(NC) U3.C2(VDDI)
NetR1_2: R1.2 U6.1 U7.7(DAT0(D0))
NetR2_2: R2.2 U5.1 U7.8(DAT1(RSV))
NetR3_2: R3.2 U4.1 U7.1(DAT2(RSV))
NetR4_2: R4.2 U7.2(CDDAT3(CS)) U10.2
NetR5_2: R5.2 U7.3(CMD(DI)) U9.2
NetR6_2: R6.2 U7.9(CD) U11.2

Not connected (* = marked no-connect by the designer): U3 A1(NC)* A8(NC)* A9(NC)* A10(NC)* A11(NC)* A12(NC)* A13(NC)* A14(NC)* B1(NC)* B7(NC)* B8(NC)* B9(NC)* B10(NC)* B11(NC)* B12(NC)* B13(NC)* B14(NC)* C3(NC)* C7(NC)* C8(NC)* C9(NC)* C10(NC)* C11(NC)* C12(NC)* C13(NC)* C14(NC)* D1(NC)* D2(NC)* D3(NC)* D4(NC)* D12(NC)* D13(NC)* D14(NC)* E1(NC)* E2(NC)* E3(NC)* E5(NC)* E8(NC)* E9(VSF1)* E10(VSF1)* E12(NC)* E13(NC)* E14(NC)* F1(NC)* F2(NC)* F3(NC)* F10(VSF3)* F12(NC)* F13(NC)* F14(NC)* G1(NC)* G2(NC)* G3(NC)* G10(NC)* G12(NC)* G13(NC)* G14(NC)* H1(NC)* H2(NC)* H3(NC)* H12(NC)* H13(NC)* H14(NC)* J1(NC)* J2(NC)* J3(NC)* J12(NC)* J13(NC)* J14(NC)* K1(NC)* K2(NC)* K3(NC)* K6(NC)* K7(NC)* K10(VSF4)* K12(NC)* K13(NC)* K14(NC)* L1(NC)* L2(NC)* L3(NC)* L12(NC)* L13(NC)* L14(NC)* M1(NC)* M2(NC)* M3(NC)* M7(NC)* M8(NC)* M9(NC)* M10(NC)* M11(NC)* M12(NC)* M13(NC)* M14(NC)* N1(NC)* N3(NC)* N6(NC)* N7(NC)* N8(NC)* N9(NC)* N10(NC)* N11(NC)* N12(NC)* N13(NC)* N14(NC)* P1(NC)* P2(NC) P7(NC)* P8(NC)* P9(NC)* P10(NC)* P11(NC)* P12(NC)* P13(NC)* P14(NC)*

### Library data of the parts
C158 = 2.2uF: 50V 2.2uF NP0 0402 Ceramic Capacitors ROHS
C159-C163 C165 C166 C191 = 100nF: as C5-C20 on sheet LPDDR4
C164 C167 = 4.7uF: as C135 on sheet RK3566_POWER
C190 = 10uF: as C128 on sheet RK3566_POWER
R1-R6 = 22Ω: 62.5mW 33Ω 50V ±100ppm/℃ Thick Film Resistor ±1% 0402 Chip Resistor - Surface Mount ROHS
R64-R66 R114 = 10kΩ: 62.5mW 10kΩ 50V ±100ppm/℃ Thick Film Resistor ±1% 0402 Chip Resistor - Surface Mount ROHS
U4-U6 U8-U11 = ESD5451N_C5261080: 9A 9.8V 8V Bidirectional 5V DFN1006-2L TVS Diodes ROHS; Manufacturer: HXY MOSFET(华轩阳电子); Add into BOM: yes; Reverse Leakage Current (Ir): 500nA; Number of Channels: 1.0; level of protection: IEC 61000-4-2; Junction Capacitance: 15pF; Symbol: ESD5451N_C5261080; Device: ESD5451N_C5261080; LCSC Part Name: 5V 15pF 双向; Supplier Part: C5261080; Manufacturer Part: ESD5451N; Supplier Footprint: DFN1006-2L; JLCPCB Part Class: Extended Part; Datasheet: https://item.szlcsc.com/datasheet/ESD5451N/5983779.html; Supplier: LCSC; Convert to PCB: yes; Polarity: Bidirectional; Reverse Stand-Off Voltage (Vrwm): 5V; Clamping Voltage: 9.8V; Peak Pulse Current (Ipp): 9A; Voltage - Breakdown: 8V; Type: ESD
U7 = TF-01A_C91145: Push-Push 1.85mm Connector and Ejector MicroSD Card (TF Card) SMD PC Card Sockets ROHS
U3 = SDINBDG4-8G: Symbol: SDINBDG4-8G

## Sheet Wi-Fi_BT.SchDoc
size A3; SheetNumber: 7; SheetTotal: 20
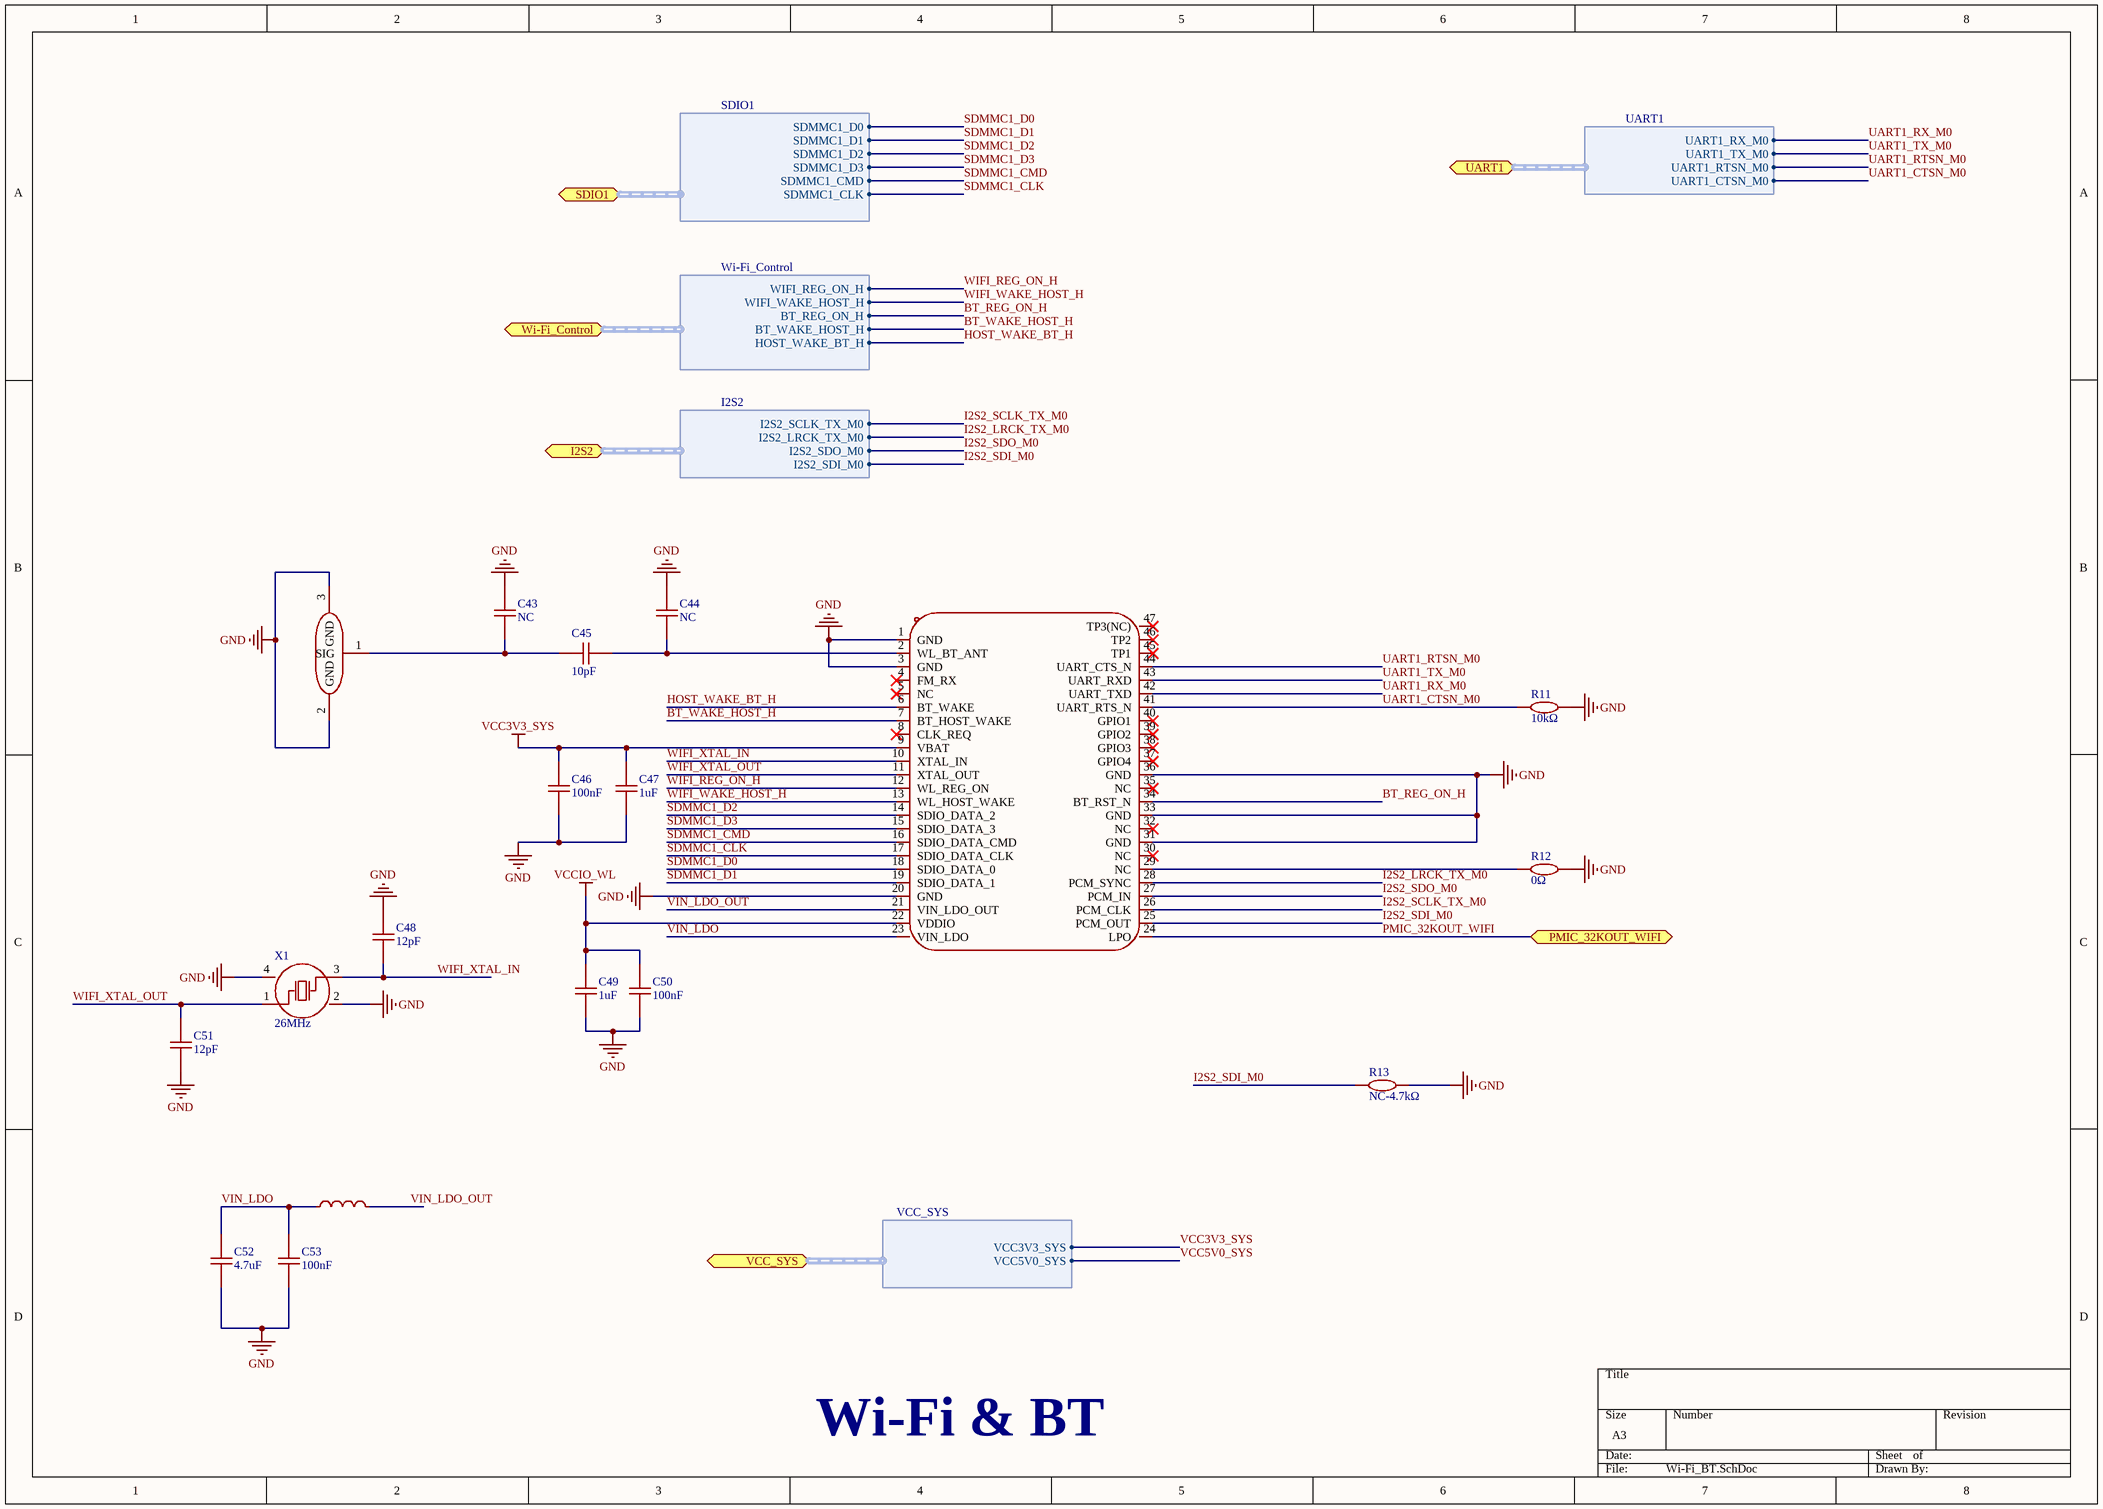
[diagram p10: Wi-Fi_BT.SchDoc]

### Parts
C43  NC  [C0402]
C44  NC  [C0402]
C45  10pF  [C0402]
C46  100nF  [C0402]
C47  1uF  [C0402]
C48  12pF  [C0402]
C49  1uF  [C0402]
C50  100nF  [C0402]
C51  12pF  [C0402]
C52  4.7uF  [C0402]
C53  100nF  [C0402]
JP1  6GHz  [RF-SMD_FRF05002-JSS103M]  (value not drawn)
L1  4.7uH  [L1008]  (value not drawn)
R11  10kΩ  [R0402]
R12  0Ω  [R0402]
R13  NC-4.7kΩ  [R0402]
U12  2.4GHz  [QFN-44_L12.0-W12.0-P0.90-TL_AP6212]  (value not drawn)
X1  26MHz  [CRYSTAL-SMD_4P-L2.0-W1.6-BL]

### Ports
I2S2 (bidir, harness I2S2, see Overview[6C], RK3566[3B], RK3566_FLASH_SD_SARADC[6B]), PMIC_32KOUT_WIFI (bidir, see Overview[7C], POWER[3D], POWER_PMIC[7A]), SDIO1 (bidir, harness SDIO1, see Overview[6C], RK3566[3B], RK3566_FLASH_SD_SARADC[6A]), UART1 (bidir, harness UARt1, see Overview[6C], RK3566[3B], RK3566_FLASH_SD_SARADC[6B]), VCC_SYS (bidir, harness VCC_SYS, see Overview[7C], Audio_AND_HPJ[3A], DEBUG_AND_GPIO[1D], HDMI[2C], MIPI_DSI_TP[6A], POWER[3B], POWER[6B], POWER_EXTENSION[4D], POWER_FLASH_POWER_MANAGE[3C], POWER_PMIC[6D]), Wi-Fi_Control (bidir, harness Wi-Fi_Control, see Overview[6C], RK3566[3B], RK3566_FLASH_SD_SARADC[6A])

### Harnesses
SDIO1: SDMMC1_D0, SDMMC1_D1, SDMMC1_D2, SDMMC1_D3, SDMMC1_CMD, SDMMC1_CLK
Wi-Fi_Control: WIFI_REG_ON_H, WIFI_WAKE_HOST_H, BT_REG_ON_H, BT_WAKE_HOST_H, HOST_WAKE_BT_H
I2S2: I2S2_SCLK_TX_M0, I2S2_LRCK_TX_M0, I2S2_SDO_M0, I2S2_SDI_M0
UART1: UART1_RX_M0, UART1_TX_M0, UART1_RTSN_M0, UART1_CTSN_M0
VCC_SYS: VCC3V3_SYS, VCC5V0_SYS

### Nets
GND: C43.2 C44.2 C46.1 C47.1 C48.2 C49.1 C50.1 C51.1 C52.1 C53.1 JP1.2(GND) JP1.3(GND) R11.2 R12.2 R13.2 U12.1(GND) U12.3(GND) U12.20(GND) U12.31(GND) U12.33(GND) U12.36(GND) X1.2(GND) X1.4(GND)
VCC3V3_SYS: C46.2 C47.2 U12.9(VBAT) ; port VCC_SYS.VCC3V3_SYS
VCCIO_WL: C49.2 C50.2 U12.22(VDDIO)
BT_REG_ON_H: U12.34(BT_RST_N) ; port Wi-Fi_Control.BT_REG_ON_H
BT_WAKE_HOST_H: U12.7(BT_HOST_WAKE) ; port Wi-Fi_Control.BT_WAKE_HOST_H
HOST_WAKE_BT_H: U12.6(BT_WAKE) ; port Wi-Fi_Control.HOST_WAKE_BT_H
I2S2_LRCK_TX_M0: U12.28(PCM_SYNC) ; port I2S2.I2S2_LRCK_TX_M0
I2S2_SCLK_TX_M0: U12.26(PCM_CLK) ; port I2S2.I2S2_SCLK_TX_M0
I2S2_SDI_M0: R13.1 U12.25(PCM_OUT) ; port I2S2.I2S2_SDI_M0
I2S2_SDO_M0: U12.27(PCM_IN) ; port I2S2.I2S2_SDO_M0
PMIC_32KOUT_WIFI: U12.24(LPO) ; port PMIC_32KOUT_WIFI
SDMMC1_CLK: U12.17(SDIO_DATA_CLK) ; port SDIO1.SDMMC1_CLK
SDMMC1_CMD: U12.16(SDIO_DATA_CMD) ; port SDIO1.SDMMC1_CMD
SDMMC1_D0: U12.18(SDIO_DATA_0) ; port SDIO1.SDMMC1_D0
SDMMC1_D1: U12.19(SDIO_DATA_1) ; port SDIO1.SDMMC1_D1
SDMMC1_D2: U12.14(SDIO_DATA_2) ; port SDIO1.SDMMC1_D2
SDMMC1_D3: U12.15(SDIO_DATA_3) ; port SDIO1.SDMMC1_D3
UART1_CTSN_M0: R11.1 U12.41(UART_RTS_N) ; port UART1.UART1_CTSN_M0
UART1_RTSN_M0: U12.44(UART_CTS_N) ; port UART1.UART1_RTSN_M0
UART1_RX_M0: U12.42(UART_TXD) ; port UART1.UART1_RX_M0
UART1_TX_M0: U12.43(UART_RXD) ; port UART1.UART1_TX_M0
VIN_LDO: C52.2 C53.2 L1.1 U12.23(VIN_LDO)
VIN_LDO_OUT: L1.2 U12.21(VIN_LDO_OUT)
WIFI_REG_ON_H: U12.12(WL_REG_ON) ; port Wi-Fi_Control.WIFI_REG_ON_H
WIFI_WAKE_HOST_H: U12.13(WL_HOST_WAKE) ; port Wi-Fi_Control.WIFI_WAKE_HOST_H
WIFI_XTAL_IN: C48.1 U12.10(XTAL_IN) X1.3(OSC2)
WIFI_XTAL_OUT: C51.2 U12.11(XTAL_OUT) X1.1(OSC1)
NetC43_1: C43.1 C45.1 JP1.1(SIG)
NetC44_1: C44.1 C45.2 U12.2(WL_BT_ANT)
NetR12_1: R12.1 U12.29(NC)

Not connected (* = marked no-connect by the designer): U12 4(FM_RX)* 5(NC)* 8(CLK_REQ)* 30(NC)* 32(NC)* 35(NC)* 37(GPIO4)* 38(GPIO3)* 39(GPIO2)* 40(GPIO1)* 45(TP1)* 46(TP2)* 47(TP3(NC))*

### Notes on the sheet
- Wi-Fi & BT

### Library data of the parts
C43 C44 = 1nF: 50V 1nF X7R ±10% 0402 Ceramic Capacitors ROHS
C45 = 10pF: 50V 10pF C0G ±5% 0402 Ceramic Capacitors ROHS
C46 C50 C53 = 100nF: as C5-C20 on sheet LPDDR4
C47 C49 = 1uF: as C4 on sheet LPDDR4
C48 C51 = 12pF: 50V 12pF C0G ±5% 0402 Ceramic Capacitors ROHS
C52 = 4.7uF: as C135 on sheet RK3566_POWER
JP1 = U.FL-R-SMT-1(80)_C88374: Manufacturer: HRS(广濑); Add into BOM: yes; Connector Type: Board Side; Interface: Male Pin; Number of Ports: 1; Interface Diameter: 2mm; Interface Length/Height: 1.25mm; RF Series: IPEX; Impedance: 50Ω; Symbol: U.FL-R-SMT-1(80); Device: U.FL-R-SMT-1(80)_C88374; LCSC Part Name: IPEX 内针; Supplier Part: C88374; Manufacturer Part: U.FL-R-SMT-1(80); Supplier Footprint: SMD; JLCPCB Part Class: Extended Part; Datasheet: https://item.szlcsc.com/datasheet/U.FL-R-SMT-1(80)/89553.html; Supplier: LCSC; Convert to PCB: yes; Value: 6GHz; Style: -; Operating Temperature Range: -40℃~+90℃
L1 = MLP2520S4R7MT0S1: SMD 1008 4.7uH ±20%; Manufacturer: Sunltech(顺磁); Symbol: SLW4030S1R0NST; Add into BOM: yes; Value: 1uH; Tolerance: ±30%; Current Rating: 4.15A; DC Resistance(DCR): 18mΩ; Device: SLW4030S1R0NST; LCSC Part Name: 1uH ±30%; Supplier Part: C206354; Manufacturer Part: SLW4030S1R0NST; Supplier Footprint: SMD,4x4mm; JLCPCB Part Class: Extended Part; Datasheet: https://item.szlcsc.com/datasheet/SLW4030S1R0NST/207399.html; Supplier: LCSC; Convert to PCB: yes
R11 = 10kΩ: as R64-R66 on sheet EMMC_SD
R12 = 0Ω: as R63 on sheet LPDDR4
R13 = 5.1kΩ: 5.1kΩ 62.5mW 50V ±100ppm/℃ Thick Film Resistor ±1% 0402 Chip Resistor - Surface Mount ROHS
U12 = AP6212: 2.4GHz -90dBm QFN-44(12x12) RF Transceiver Modules and Modems ROHS; Manufacturer: AMPAK(正基科技); Add into BOM: yes; Interface Type: On-board PCB antenna; Output Power: 16dBm; Symbol: AP6212; Device: AP6212; LCSC Part Name: AP6212; Supplier Part: C2798300; Manufacturer Part: AP6212; Supplier Footprint: QFN-44(12x12); JLCPCB Part Class: Extended Part; Datasheet: https://item.szlcsc.com/datasheet/AP6212/2941698.html; Supplier: LCSC; Convert to PCB: yes; Utilized IC / Part: -; Wireless Standard: -; Value: 2.4GHz; Antenna Type: -; Voltage - Supply: -; Receive  Current: -; Send  Current: -; Sensitivity: -90dBm; Operating Temperature: -30℃~+85℃
X1 = Q22FA12800230: Q22FA12800230 26MHz ±10ppm 10pF

## Sheet HDMI.SchDoc
size A3; SheetNumber: 8; SheetTotal: 20
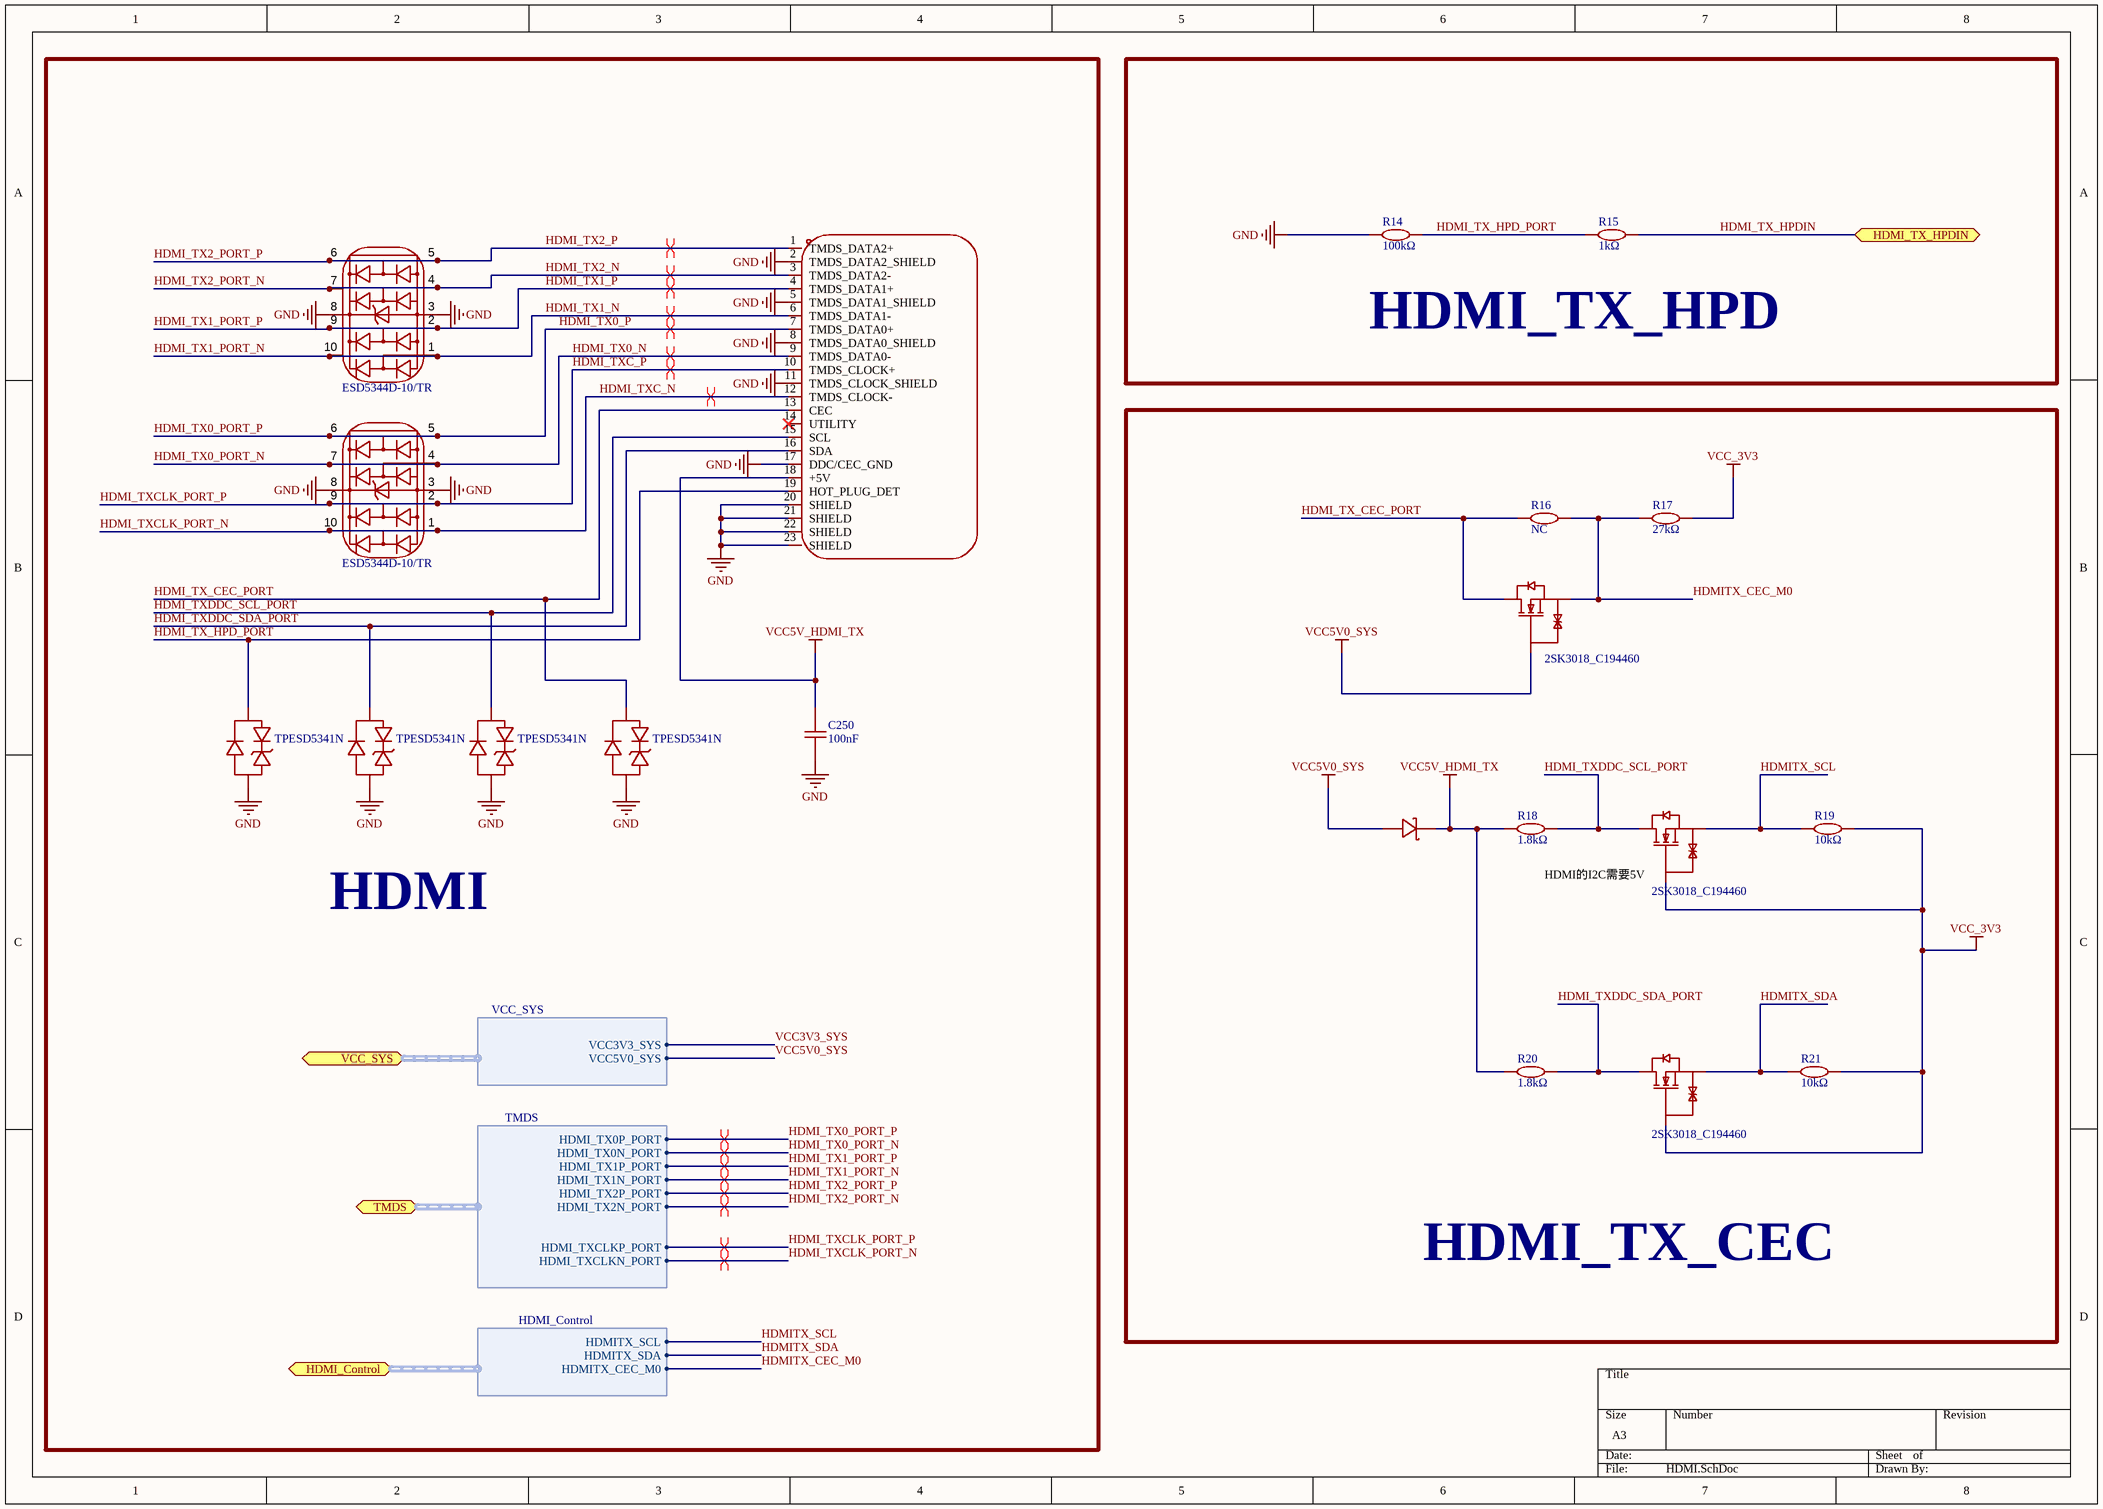
[diagram p11: HDMI.SchDoc]

### Parts
C250  100nF  [C0402]
CN1  KH-HDMI-19P-Cu  [HDMI-SMD_KH-HDMI-19P-CU]  (value not drawn)
D1  ESD5344D-10/TR  [DFN2510-10_L2.5-W1.0-P0.50-BL]
D2  ESD5344D-10/TR  [DFN2510-10_L2.5-W1.0-P0.50-BL]
D3  TPESD5341N  [X1-DFN1006-2_L1.0-W0.6-RD]
D4  TPESD5341N  [X1-DFN1006-2_L1.0-W0.6-RD]
D5  TPESD5341N  [X1-DFN1006-2_L1.0-W0.6-RD]
D6  TPESD5341N  [X1-DFN1006-2_L1.0-W0.6-RD]
D7  1N5819WS  [SOD-323_L1.8-W1.3-LS2.5-RD]  (value not drawn)
Q1  2SK3018_C194460  [SOT-23-3_L2.9-W1.3-P1.90-LS2.3-BR]
Q2  2SK3018_C194460  [SOT-23-3_L2.9-W1.3-P1.90-LS2.3-BR]
Q3  2SK3018_C194460  [SOT-23-3_L2.9-W1.3-P1.90-LS2.3-BR]
R14  100kΩ  [R0402]
R15  1kΩ  [R0402]
R16  NC  [R0402]
R17  27kΩ  [R0402]
R18  1.8kΩ  [R0402]
R19  10kΩ  [R0402]
R20  1.8kΩ  [R0402]
R21  10kΩ  [R0402]

### Blocks framed on the sheet
HDMI: C250 CN1 D1-D6
HDMI_TX_HPD: R14 R15
HDMI_TX_CEC: D7 Q1-Q3 R16-R21

### Ports
HDMI_Control (bidir, harness HDMI_Control, see Overview[6D], RK3566[3C], RK3566_USB_GPIO[5A]), HDMI_TX_HPDIN (bidir, see Overview[6D], RK3566[3A], RK3566_MIPI_HDMI[1C]), TMDS (bidir, harness TMDS, see Overview[6D], RK3566[3A], RK3566_MIPI_HDMI[2A]), VCC_SYS (bidir, harness VCC_SYS, see Overview[7D], Audio_AND_HPJ[3A], DEBUG_AND_GPIO[1D], MIPI_DSI_TP[6A], POWER[3B], POWER[6B], POWER_EXTENSION[4D], POWER_FLASH_POWER_MANAGE[3C], POWER_PMIC[6D], Wi-Fi_BT[3D])

### Harnesses
TMDS: HDMI_TX0P_PORT, HDMI_TX0N_PORT, HDMI_TX1P_PORT, HDMI_TX1N_PORT, HDMI_TX2P_PORT, HDMI_TX2N_PORT, HDMI_TXCLKP_PORT, HDMI_TXCLKN_PORT
HDMI_Control: HDMITX_SCL, HDMITX_SDA, HDMITX_CEC_M0
VCC_SYS: VCC3V3_SYS, VCC5V0_SYS

### Nets
GND: C250.1 CN1.2(TMDS_DATA2_SHIELD) CN1.5(TMDS_DATA1_SHIELD) CN1.8(TMDS_DATA0_SHIELD) CN1.11(TMDS_CLOCK_SHIELD) CN1.17(DDC/CEC_GND) CN1.20(SHIELD) CN1.21(SHIELD) CN1.22(SHIELD) CN1.23(SHIELD) D1.3 D1.8 D2.3 D2.8 D3.2 D4.2 D5.2 D6.2 R14.1
VCC5V0_SYS: D7.2(A) Q1.1(G) ; port VCC_SYS.VCC5V0_SYS
VCC5V_HDMI_TX: C250.2 CN1.18(+5V) D7.1(K) R18.1 R20.1
VCC_3V3: Q2.1(G) Q3.1(G) R17.2 R19.2 R21.2
HDMI_TX0_N: CN1.9(TMDS_DATA0-) D2.4 D2.7 ; port TMDS.HDMI_TX0N_PORT  [also labelled HDMI_TX0_PORT_N]
HDMI_TX0_P: CN1.7(TMDS_DATA0+) D2.5 D2.6 ; port TMDS.HDMI_TX0P_PORT  [also labelled HDMI_TX0_PORT_P]
HDMI_TX1_N: CN1.6(TMDS_DATA1-) D1.1 D1.10 ; port TMDS.HDMI_TX1N_PORT  [also labelled HDMI_TX1_PORT_N]
HDMI_TX1_P: CN1.4(TMDS_DATA1+) D1.2 D1.9 ; port TMDS.HDMI_TX1P_PORT  [also labelled HDMI_TX1_PORT_P]
HDMI_TX2_N: CN1.3(TMDS_DATA2-) D1.4 D1.7 ; port TMDS.HDMI_TX2N_PORT  [also labelled HDMI_TX2_PORT_N]
HDMI_TX2_P: CN1.1(TMDS_DATA2+) D1.5 D1.6 ; port TMDS.HDMI_TX2P_PORT  [also labelled HDMI_TX2_PORT_P]
HDMI_TX_CEC_PORT: CN1.13(CEC) D6.1 Q1.3(D) R16.1
HDMI_TX_HPD_PORT: CN1.19(HOT_PLUG_DET) D3.1 R14.2 R15.1
HDMI_TX_HPDIN: R15.2 ; port HDMI_TX_HPDIN
HDMI_TXC_N: CN1.12(TMDS_CLOCK-) D2.1 D2.10 ; port TMDS.HDMI_TXCLKN_PORT  [also labelled HDMI_TXCLK_PORT_N]
HDMI_TXC_P: CN1.10(TMDS_CLOCK+) D2.2 D2.9 ; port TMDS.HDMI_TXCLKP_PORT  [also labelled HDMI_TXCLK_PORT_P]
HDMI_TXDDC_SCL_PORT: CN1.15(SCL) D5.1 Q2.3(D) R18.2
HDMI_TXDDC_SDA_PORT: CN1.16(SDA) D4.1 Q3.3(D) R20.2
HDMITX_CEC_M0: Q1.2(S) R16.2 R17.1 ; port HDMI_Control.HDMITX_CEC_M0
HDMITX_SCL: Q2.2(S) R19.1 ; port HDMI_Control.HDMITX_SCL
HDMITX_SDA: Q3.2(S) R21.1 ; port HDMI_Control.HDMITX_SDA

Not connected (* = marked no-connect by the designer): CN1 14(UTILITY)*

### Layout directives
differential pair: HDMI_TX0_N, HDMI_TX0_P, HDMI_TX1_N, HDMI_TX1_P, HDMI_TX2_N, HDMI_TX2_P, HDMI_TXC_N, HDMI_TXC_P

### Notes on the sheet
- (near Q2) HDMI的I2C需要5V

### Library data of the parts
C250 = 100nF: as C5-C20 on sheet LPDDR4
CN1 = KH-HDMI-19P-Cu: HDMI-A SMD USB, DVI, HDMI Connector Assemblies ROHS; Manufacturer: kinghelm(金航标); Add into BOM: yes; Gender: Mother; Symbol: KH-HDMI-19P-CU; Device: KH-HDMI-19P-Cu; LCSC Part Name: KH-HDMI-19P-Cu; Supplier Part: C709361; Manufacturer Part: KH-HDMI-19P-Cu; Supplier Footprint: SMD; JLCPCB Part Class: Extended Part; Datasheet: https://atta.szlcsc.com/upload/public/pdf/source/20211208/D47DE7411E98B8CA58BDDFA754B04DEC.pdf; Supplier: LCSC; Convert to PCB: yes; Connector Type: HDMI-A; Number of Pins: 19P; Mounting Style: Horizontal attachment; Current Rating (Max): -; Rated Voltage (Max): -; Operating Temperature Range: -
D1 D2 = ESD5344D-10/TR: ESD5344D是一款超低电容TVS（瞬态电压抑制器）阵列，旨在保护高速数据接口。它专门用于保护连接到数据和传输线路的敏感电子元件，使其免受ESD（静电放电）引起的过应力影响。ESD5344D集成了四对超低电容转向二极管和一个TVS二极管。根据IEC61000 - 4 - 2标准，ESD5344D可提供高达±20kV（接触放电）的ESD保护；根据IEC61000 - 4 - 5标准，它能承受高达4A（8/20μs）的峰值脉冲电流。ESD5344D采用DFN2510 - 10L封装。标准产品无铅且无卤素。; Symbol: ESD5344D-10/TR
D3-D6 = TPESD5341N: VRWM:5V, IPP:3.3A, CJ:0.35pF; Symbol: TPESD5341N
D7 = 1N5819WS_C191023: 25A 40V 600mV@1A 1A SOD-323 Single Diodes ROHS; Manufacturer: Hottech(合科泰); Add into BOM: yes; Symbol: 1N5819WS; Device: 1N5819WS_C191023; LCSC Part Name: 电压:40V 电流:1A; Supplier Part: C191023; Manufacturer Part: 1N5819WS; Supplier Footprint: SOD-323; JLCPCB Part Class: Basic Part; Datasheet: https://item.szlcsc.com/datasheet/1N5819WS/213850.html; Supplier: LCSC; Convert to PCB: yes; Voltage - Forward(Vf@If): 600mV@1A; Voltage - DC Reverse(Vr): 40V; Current - Rectified: 1A; Non-Repetitive Peak Forward Surge Current: 25A
Q1-Q3 = 2SK3018_C194460: N沟道,30V,100mA; Symbol: 2SK3018_C194460
R14 = 100kΩ: 100kΩ 62.5mW 50V ±100ppm/℃ Thick Film Resistor ±1% 0402 Chip Resistor - Surface Mount ROHS
R15 = 1kΩ: 1kΩ 62.5mW 50V ±100ppm/℃ Thick Film Resistor ±1% 0402 Chip Resistor - Surface Mount ROHS
R16 = 0Ω: as R63 on sheet LPDDR4
R17 = 27kΩ: 小尺寸、重量轻。降低组装成本,与贴片机匹配。适用于波峰焊和回流焊
R18 R20 = 1.8kΩ: 62.5mW 1.8kΩ 50V ±100ppm/℃ Thick Film Resistor ±1% 0402 Chip Resistor - Surface Mount ROHS
R19 R21 = 10kΩ: as R64-R66 on sheet EMMC_SD

## Sheet MIPI_DSI_TP.SchDoc
size A3; SheetNumber: 9; SheetTotal: 20
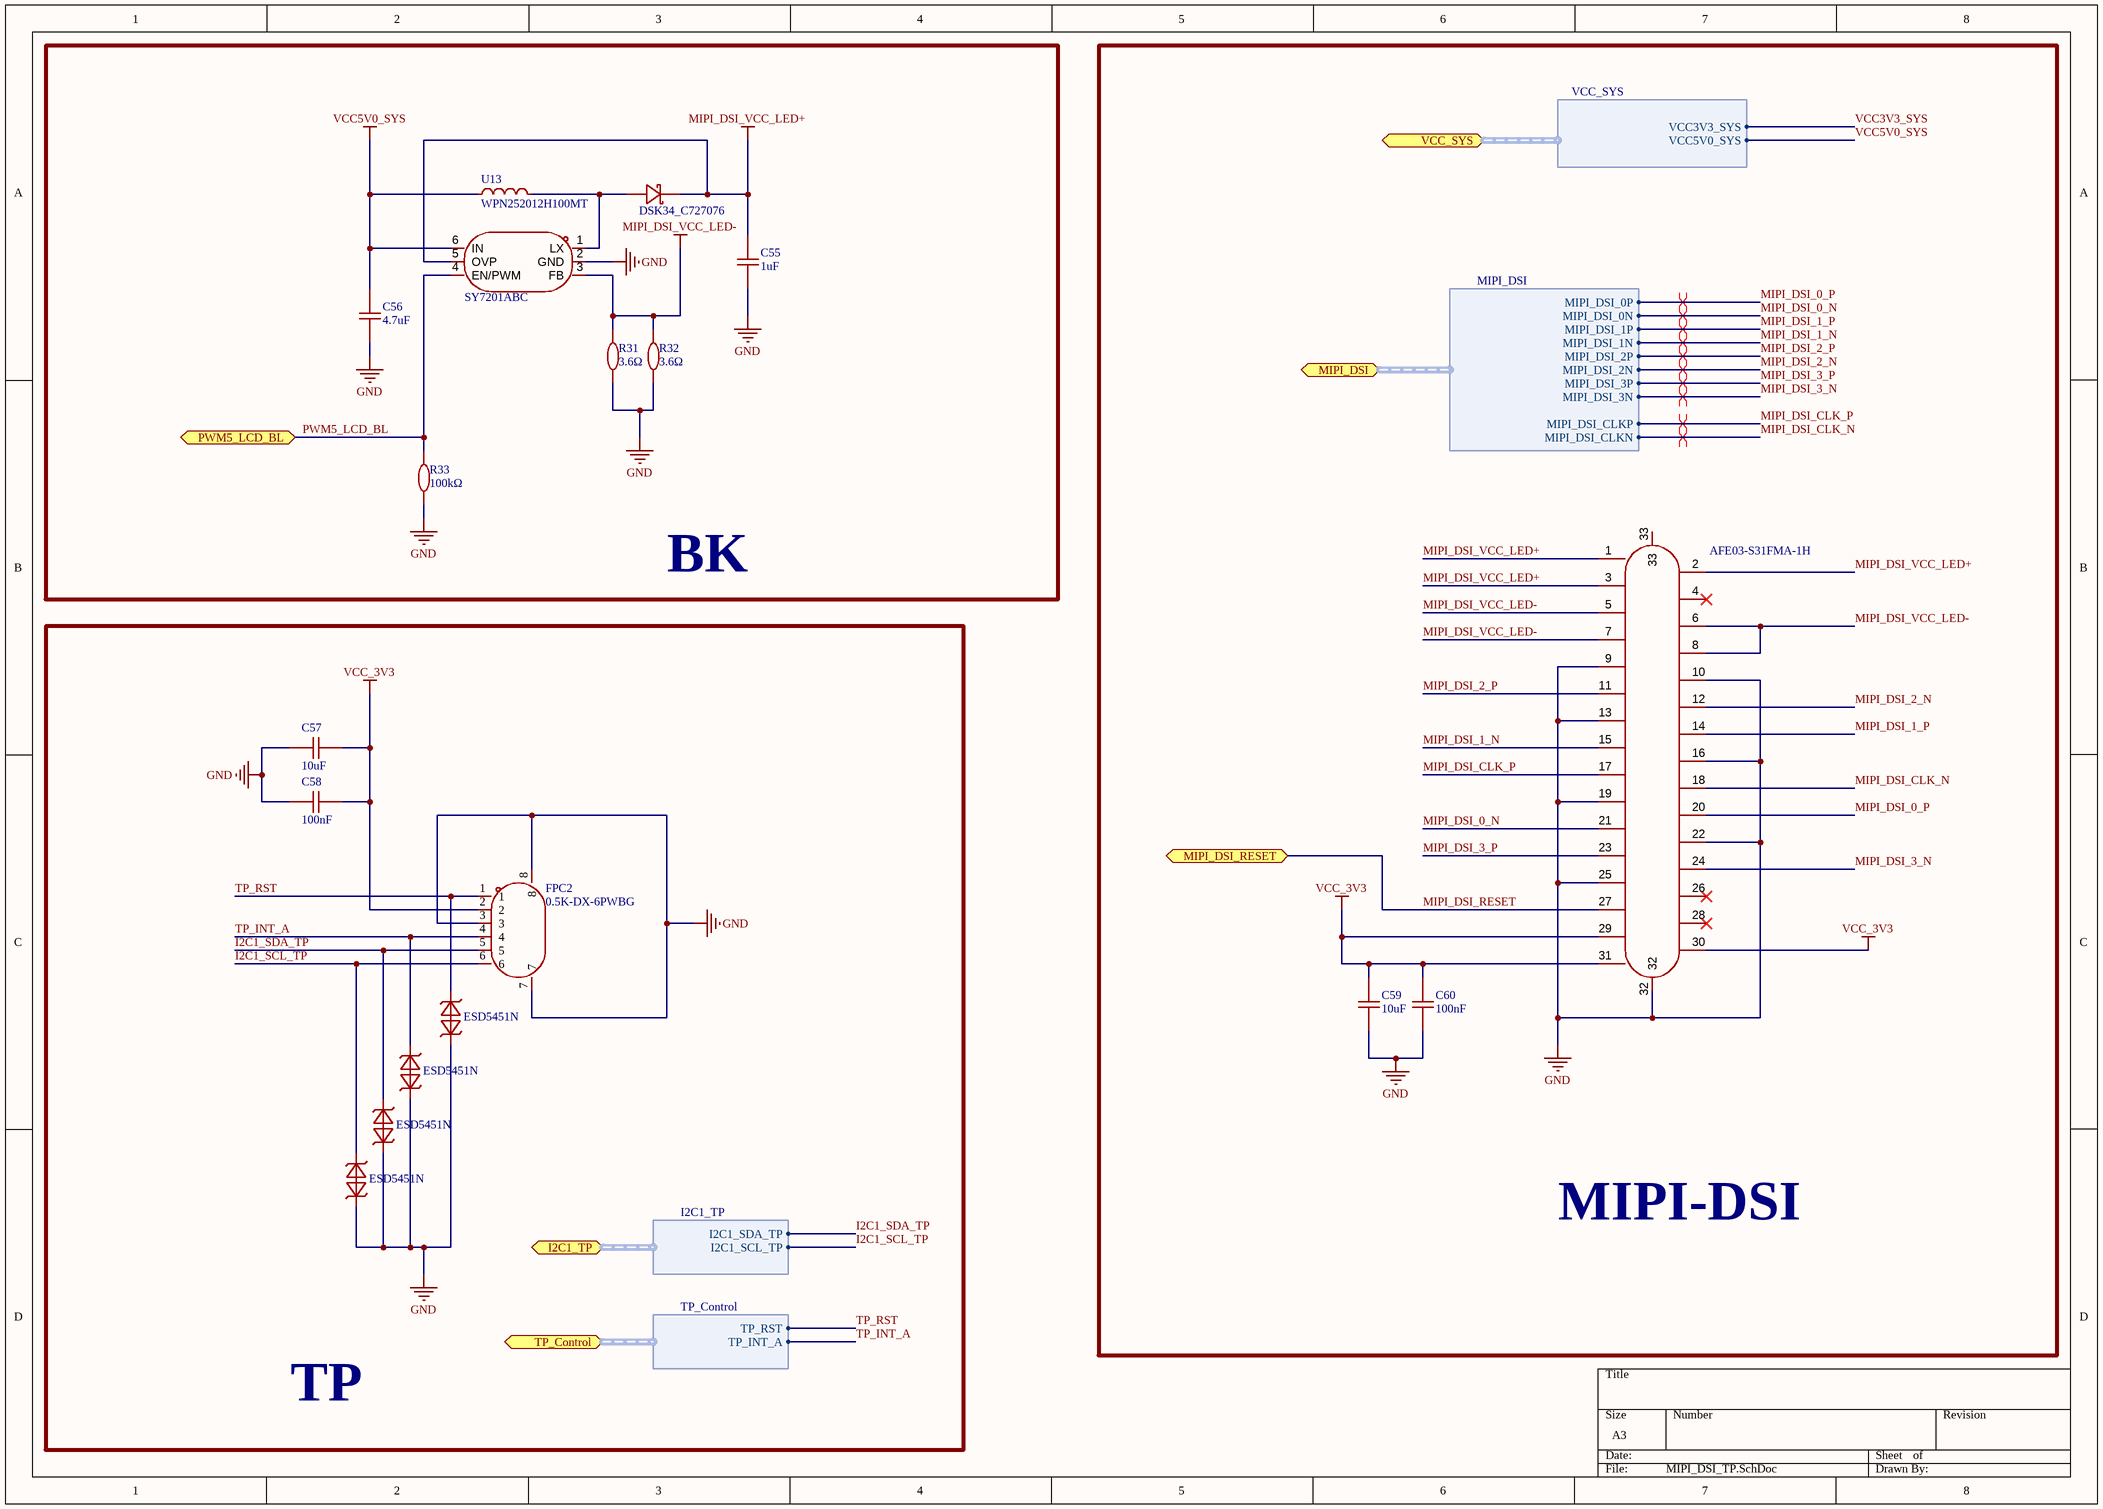
[diagram p12: MIPI_DSI_TP.SchDoc]

### Parts
C55  1uF  [C0402]
C56  4.7uF  [C0402]
C57  10uF  [C0603]
C58  100nF  [C0402]
C59  10uF  [C0603]
C60  100nF  [C0402]
D8  DSK34_C727076  [SOD-323_L1.8-W1.3-LS2.5-RD]
FPC1  AFE03-S31FMA-1H  [FPC-SMD_P0.30-31P_FGS-XJ-H1.0]
FPC2  0.5K-DX-6PWBG  [FPC-SMD_6P-P0.50_DEALON_0.5K-DX-6PWB]
R31  3.6Ω  [R0603]
R32  3.6Ω  [R0603]
R33  100kΩ  [R0402]
U13  WPN252012H100MT  [IND-SMD_L2.5-W2.0_WPN252012H]
U14  SY7201ABC  [SOT-23-6_L2.9-W1.6-P0.95-LS2.8-BR]
U15  ESD5451N  [DFN1006-2L-BI]
U16  ESD5451N  [DFN1006-2L-BI]
U17  ESD5451N  [DFN1006-2L-BI]
U18  ESD5451N  [DFN1006-2L-BI]

### Blocks framed on the sheet
BK: C55 C56 D8 R31-R33 U13 U14
MIPI-DSI: C59 C60 FPC1
TP: C57 C58 FPC2 U15-U18

### Ports
I2C1_TP (bidir, harness I2C1_TP, see Overview[2C], RK3566[3C], RK3566_OSC_PLL_PMUO1_2[1A]), MIPI_DSI (bidir, harness MIPI_DSI, see Overview[2C], RK3566[3B], RK3566_MIPI_HDMI[5A]), MIPI_DSI_RESET (bidir, see Overview[2C], RK3566[3C], RK3566_USB_GPIO[5B]), PWM5_LCD_BL (bidir, see Overview[2C], RK3566[3D], RK3566_OSC_PLL_PMUO1_2[7C]), TP_Control (bidir, harness TP_Control, see Overview[2C], RK3566[3B], RK3566_FLASH_SD_SARADC[7B]), VCC_SYS (bidir, harness VCC_SYS, see Overview[2C], Audio_AND_HPJ[3A], DEBUG_AND_GPIO[1D], HDMI[2C], POWER[3B], POWER[6B], POWER_EXTENSION[4D], POWER_FLASH_POWER_MANAGE[3C], POWER_PMIC[6D], Wi-Fi_BT[3D])

### Harnesses
MIPI_DSI: MIPI_DSI_0P, MIPI_DSI_0N, MIPI_DSI_1P, MIPI_DSI_1N, MIPI_DSI_2P, MIPI_DSI_2N, MIPI_DSI_CLKP, MIPI_DSI_3P, MIPI_DSI_3N, MIPI_DSI_CLKN
I2C1_TP: I2C1_SDA_TP, I2C1_SCL_TP
TP_Control: TP_RST, TP_INT_A
VCC_SYS: VCC3V3_SYS, VCC5V0_SYS

### Nets
GND: C55.1 C56.1 C57.1 C58.1 C59.1 C60.1 FPC1.9 FPC1.10 FPC1.13 FPC1.16 FPC1.19 FPC1.22 FPC1.25 FPC1.32 FPC2.3 FPC2.7 FPC2.8 R31.1 R32.1 R33.1 U14.2(GND) U15.1 U16.1 U17.1 U18.1
MIPI_DSI_VCC_LED+: C55.2 D8.1(K) FPC1.1 FPC1.2 FPC1.3 U14.5(OVP)
MIPI_DSI_VCC_LED-: FPC1.5 FPC1.6 FPC1.7 FPC1.8 R31.2 R32.2 U14.3(FB)
VCC5V0_SYS: C56.2 U13.1 U14.6(IN) ; port VCC_SYS.VCC5V0_SYS
VCC_3V3: C57.2 C58.2 C59.2 C60.2 FPC1.29 FPC1.30 FPC1.31 FPC2.2
I2C1_SCL_TP: FPC2.6 U18.2 ; port I2C1_TP.I2C1_SCL_TP
I2C1_SDA_TP: FPC2.5 U17.2 ; port I2C1_TP.I2C1_SDA_TP
MIPI_DSI_0_N: FPC1.21 ; port MIPI_DSI.MIPI_DSI_0N
MIPI_DSI_0_P: FPC1.20 ; port MIPI_DSI.MIPI_DSI_0P
MIPI_DSI_1_N: FPC1.15 ; port MIPI_DSI.MIPI_DSI_1N
MIPI_DSI_1_P: FPC1.14 ; port MIPI_DSI.MIPI_DSI_1P
MIPI_DSI_2_N: FPC1.12 ; port MIPI_DSI.MIPI_DSI_2N
MIPI_DSI_2_P: FPC1.11 ; port MIPI_DSI.MIPI_DSI_2P
MIPI_DSI_3_N: FPC1.24 ; port MIPI_DSI.MIPI_DSI_3N
MIPI_DSI_3_P: FPC1.23 ; port MIPI_DSI.MIPI_DSI_3P
MIPI_DSI_CLK_N: FPC1.18 ; port MIPI_DSI.MIPI_DSI_CLKN
MIPI_DSI_CLK_P: FPC1.17 ; port MIPI_DSI.MIPI_DSI_CLKP
MIPI_DSI_RESET: FPC1.27 ; port MIPI_DSI_RESET
PWM5_LCD_BL: R33.2 U14.4(EN/PWM) ; port PWM5_LCD_BL
TP_INT_A: FPC2.4 U16.2 ; port TP_Control.TP_INT_A
TP_RST: FPC2.1 U15.2 ; port TP_Control.TP_RST
NetD8_2: D8.2(A) U13.2 U14.1(LX)

Not connected (* = marked no-connect by the designer): FPC1 4* 26* 28* 33

### Layout directives
differential pair: MIPI_DSI_0_N, MIPI_DSI_0_P, MIPI_DSI_1_N, MIPI_DSI_1_P, MIPI_DSI_2_N, MIPI_DSI_2_P, MIPI_DSI_3_N, MIPI_DSI_3_P, MIPI_DSI_CLK_N, MIPI_DSI_CLK_P

### Library data of the parts
C55 = 1uF: as C4 on sheet LPDDR4
C56 = 4.7uF: as C135 on sheet RK3566_POWER
C57 C59 = 10uF: as C128 on sheet RK3566_POWER
C58 C60 = 100nF: as C5-C20 on sheet LPDDR4
D8 = DSK34_C727076: 特性：塑料封装符合UL 94V-0阻燃等级。 适用于表面贴装应用。 金属硅结，多数载流子传导。 低功耗，高效率。 内置应力消除，适合自动贴装。 高正向浪涌电流能力。 保证高温焊接：端子处250℃/10秒; Symbol: DSK34_C727076
FPC1 = AFE03-S31FMA-1H: FPC SMD,P=0.3mm,卧贴; Symbol: AFE03-S31FMA-1H
R31 R32 = 3.6Ω: 0603 3.6Ω ±1% 100mW 厚膜电阻
R33 = 100kΩ: as R14 on sheet HDMI
U13 = WPN252012H100MT: 10uH
U14 = SY7201ABC: 是一款DC/DC升压转换器，可为驱动LED提供精确的恒定电流。以1MHz的固定开关频率运行，允许该器件与小值外部陶瓷电容器和电感器一起使用。通过外部电阻器设置的调节电流驱动串联连接的LED，非常适合驱动多达八个串联的白色LED或高达30V的LED。; Symbol: SY7201ABC
U15-U18 = ESD5451N: 是双向 TVS（瞬态电压抑制器），专门用于保护连接到低速数据线和控制线的敏感电子元件，使其免受 ESD（静电放电）、EFT（电快速瞬变）和浪涌引起的过应力影响。; Symbol: ESD5451N

## Sheet POWER.SchDoc
size A3; SheetNumber: 10; SheetTotal: 20
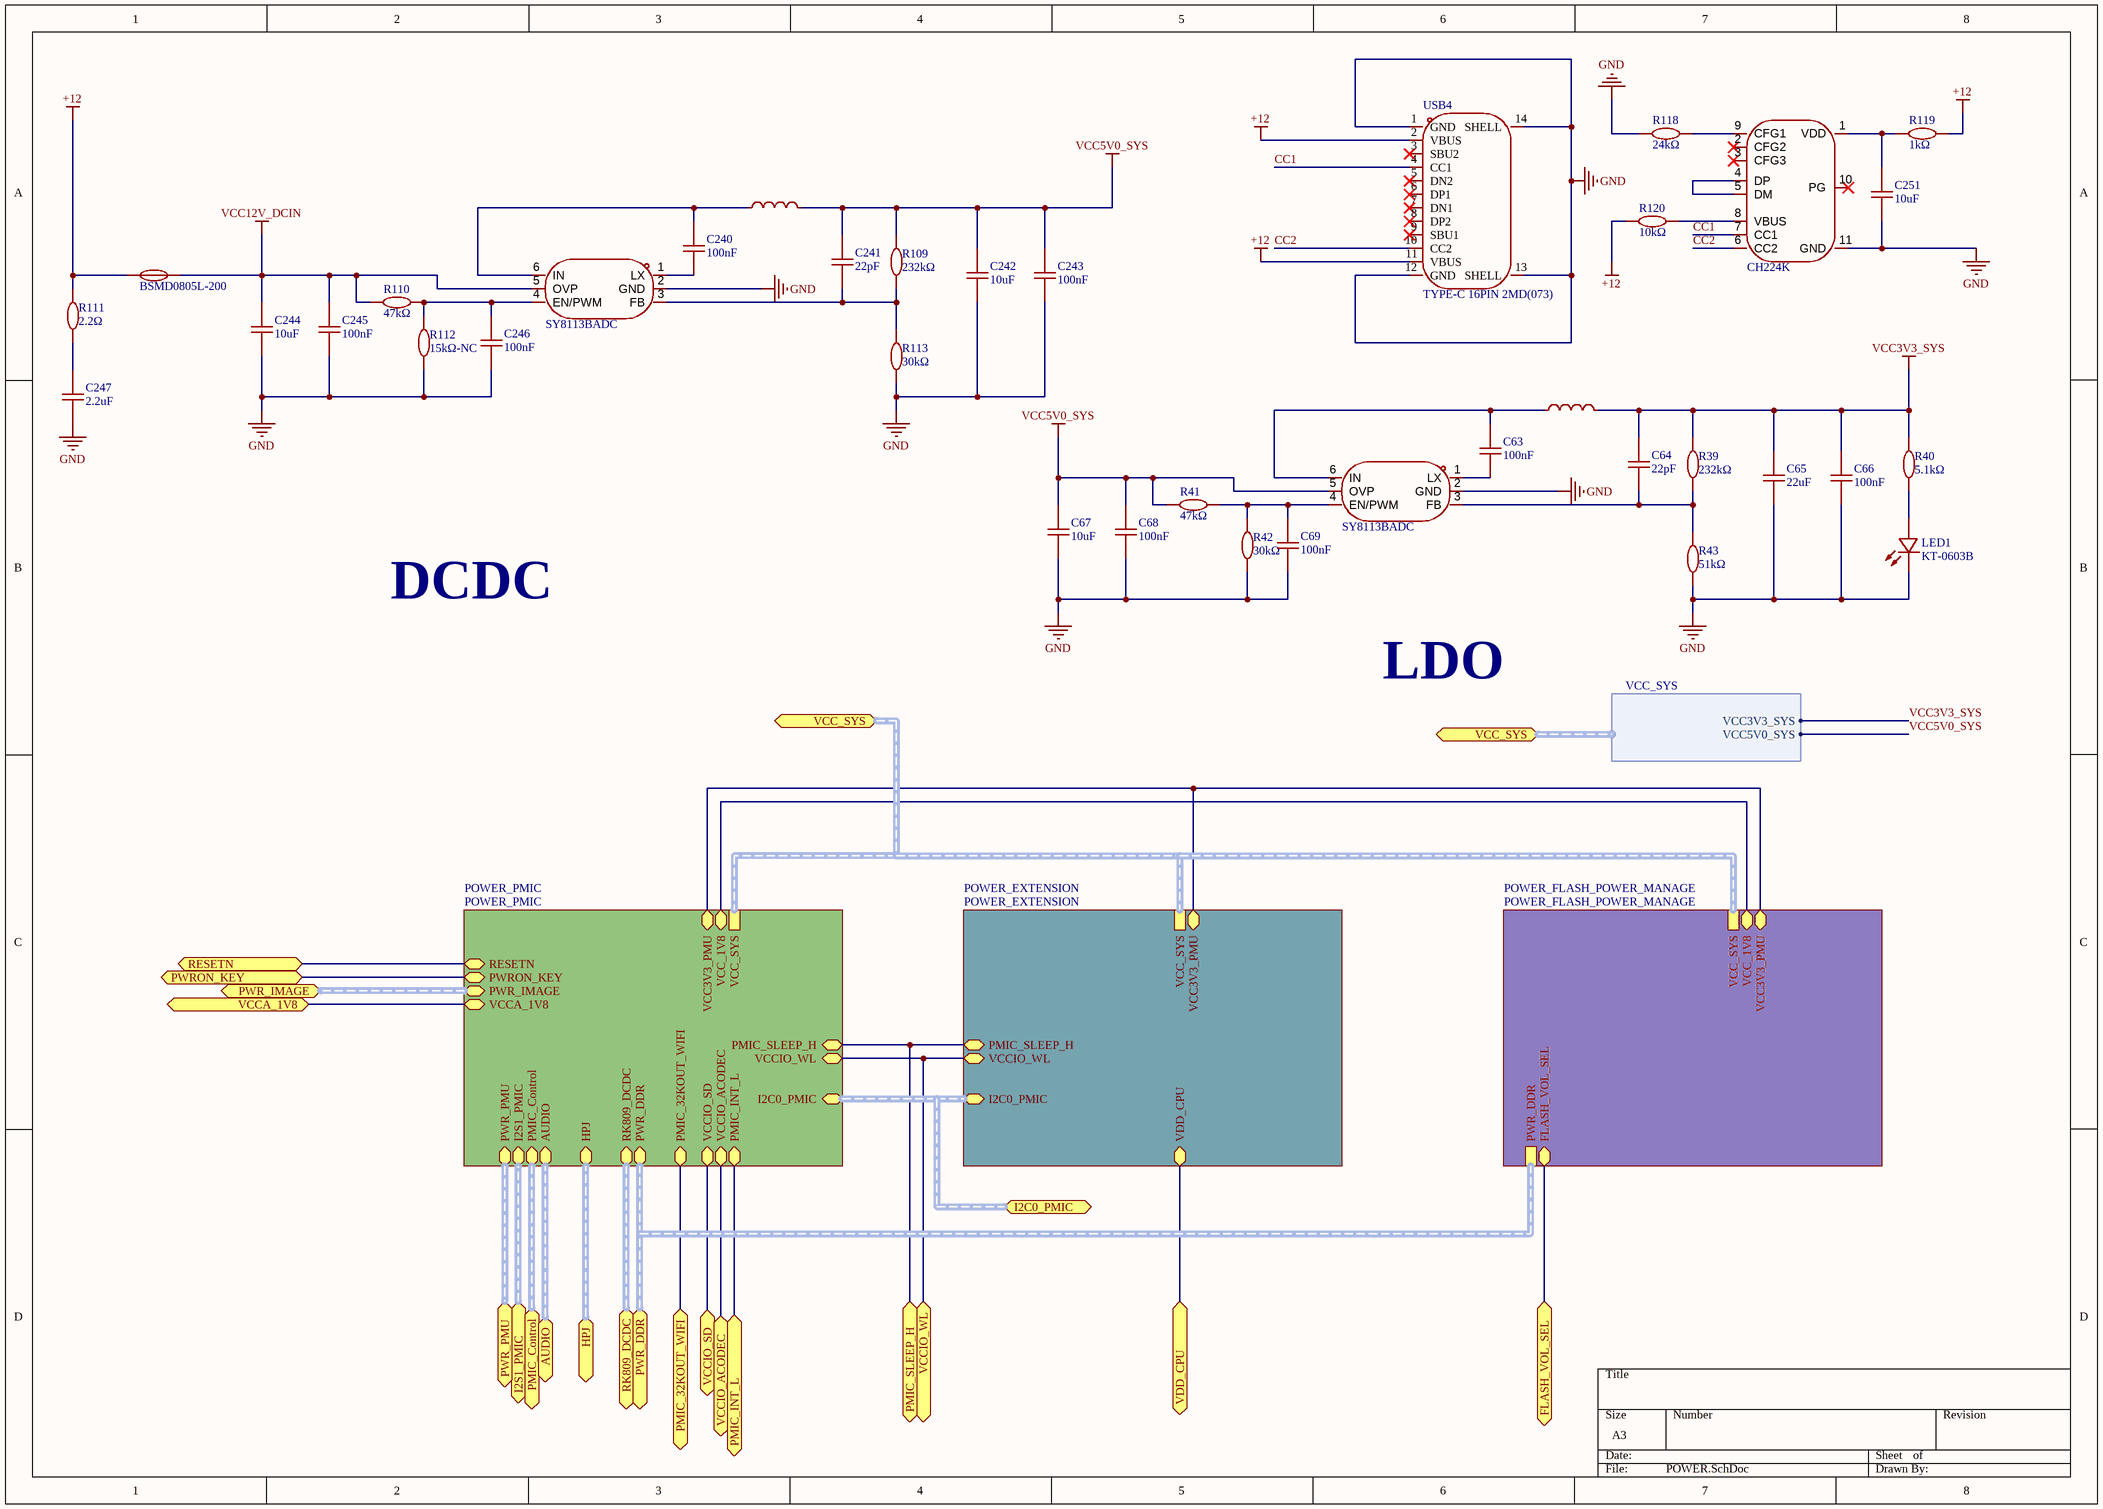
[diagram p13: POWER.SchDoc]

### Parts
C63  100nF  [C0402]
C64  22pF  [C0402]
C65  22uF  [C0603]
C66  100nF  [C0402]
C67  10uF  [C0603]
C68  100nF  [C0402]
C69  100nF  [C0402]
C240  100nF  [C0402]
C241  22pF  [C0402]
C242  10uF  [C0603]
C243  100nF  [C0402]
C244  10uF  [C0603]
C245  100nF  [C0402]
C246  100nF  [C0402]
C247  2.2uF  [C0402]
C251  10uF  [C0603]
F2  BSMD0805L-200  [F0805]
L2  3.3uH  [IND-SMD_L4.4-W4.2]  (value not drawn)
L11  6.8uH  [IND-SMD_L4.4-W4.2]  (value not drawn)
LED1  KT-0603B  [LED0603-BL]
R39  232kΩ  [R0402]
R40  5.1kΩ  [R0402]
R41  47kΩ  [R0402]
R42  30kΩ  [R0402]
R43  51kΩ  [R0402]
R109  232kΩ  [R0402]
R110  47kΩ  [R0402]
R111  2.2Ω  [R0402]
R112  15kΩ-NC  [R0402]
R113  30kΩ  [R0402]
R118  24kΩ  [R0402]
R119  1kΩ  [R0402]
R120  10kΩ  [R0402]
U19  SY8113BADC  [SOT-23-6_L2.9-W1.6-P0.95-LS2.8-BR]
U22  CH224K  [ESSOP-10_L4.9-W3.9-P1.0-LS6.0-TL-EP]
U41  SY8113BADC  [SOT-23-6_L2.9-W1.6-P0.95-LS2.8-BR]
USB4  TYPE-C 16PIN 2MD(073)  [USB-C-SMD_TYPE-C-6PIN-2MD-073]

### Sub-sheets
POWER_EXTENSION = POWER_EXTENSION: VCCIO_WL (bidir), I2C0_PMIC (bidir), PMIC_SLEEP_H (bidir), VCC3V3_PMU (bidir), VDD_CPU (bidir), VCC_SYS (harness VCC_SYS)
POWER_FLASH_POWER_MANAGE = POWER_FLASH_POWER_MANAGE: VCC3V3_PMU (bidir), FLASH_VOL_SEL (bidir), VCC_1V8 (bidir), PWR_DDR, VCC_SYS
POWER_PMIC = POWER_PMIC: VCCIO_WL (bidir), I2C0_PMIC (bidir), I2S1_PMIC (bidir), PMIC_Control (bidir), AUDIO (bidir), PMIC_SLEEP_H (bidir), RK809_DCDC (bidir), PMIC_32KOUT_WIFI (bidir), HPJ (bidir), PWR_DDR (bidir), VCCIO_SD (bidir), VCCIO_ACODEC (bidir), PWR_IMAGE (bidir), PWR_PMU (bidir), VCC3V3_PMU (bidir), PMIC_INT_L (bidir), VCC_1V8 (bidir), PWRON_KEY (bidir), RESETN (bidir), VCC_SYS (harness VCC_SYS), VCCA_1V8 (bidir)

### Ports
AUDIO (bidir, harness PMIC_Control, see Overview[4A], Audio_AND_HPJ[1A], POWER_PMIC[2D]), FLASH_VOL_SEL (bidir, see Overview[5B], POWER_FLASH_POWER_MANAGE[3A], RK3566[3D], RK3566_OSC_PLL_PMUO1_2[2B]), HPJ (bidir, harness HPJ, see Overview[4A], Audio_AND_HPJ[3C], POWER_PMIC[6D]), I2C0_PMIC (bidir, see Overview[4B], POWER_EXTENSION[4A], POWER_PMIC[1A], RK3566[3D], RK3566_OSC_PLL_PMUO1_2[5A]), I2S1_PMIC (bidir, harness I2S1_PMIC, see Overview[4B], POWER_PMIC[3A], RK3566[3B], RK3566_FLASH_SD_SARADC[6C]), PMIC_32KOUT_WIFI (bidir, see Overview[5A], POWER_PMIC[7A], Wi-Fi_BT[6C]), PMIC_Control (bidir, harness PMIC_Control, see Overview[4B], POWER_PMIC[4A], RK3566[3D], RK3566_OSC_PLL_PMUO1_2[1A]), PMIC_INT_L (bidir, see Overview[5B], POWER_PMIC[7A], RK3566[3D], RK3566_OSC_PLL_PMUO1_2[2B]), PMIC_SLEEP_H (bidir, see Overview[5B], POWER_EXTENSION[1A], POWER_PMIC[7A], RK3566[3D], RK3566_OSC_PLL_PMUO1_2[2B]), PWR_DDR (bidir, harness RK809_DCDC, see Overview[4B], POWER_FLASH_POWER_MANAGE[3B], POWER_PMIC[2D], RK3566[2A], RK3566_DDR_PHY[1A]), PWR_IMAGE (bidir, harness PWR_IMAGE, see Overview[4B], POWER_PMIC[3B], RK3566[3C], RK3566_MIPI_HDMI[5D], RK3566_USB_GPIO[1B]), PWR_PMU (bidir, harness PWR_PMU, see Overview[5B], LPDDR4[4C], POWER_PMIC[4D], RK3566[3C], RK3566_OSC_PLL_PMUO1_2[1A]), PWRON_KEY (bidir, see Overview[4A], DEBUG_AND_GPIO[8B], POWER_PMIC[7A]), RESETN (bidir, see Overview[4A], DEBUG_AND_GPIO[8D], POWER_PMIC[7A], RK3566[3C], RK3566_OSC_PLL_PMUO1_2[2B]), RK809_DCDC (bidir, harness RK809_DCDC, see Overview[4B], POWER_PMIC[1A], RK3566[3D], RK3566_POWER[2A]), VCC_SYS (bidir, harness VCC_SYS, see Overview[4A], Audio_AND_HPJ[3A], DEBUG_AND_GPIO[1D], HDMI[2C], MIPI_DSI_TP[6A], POWER_EXTENSION[4D], POWER_FLASH_POWER_MANAGE[3C], POWER_PMIC[6D], Wi-Fi_BT[3D]), VCCA_1V8 (bidir, see Overview[4A], DEBUG_AND_GPIO[5C], POWER_PMIC[7A], RK3566[3C], RK3566_USB_GPIO[6C]), VCCIO_ACODEC (bidir, see Overview[4B], POWER_PMIC[1D], RK3566[3B], RK3566_FLASH_SD_SARADC[7C]), VCCIO_SD (bidir, see Overview[4B], POWER_PMIC[2D], RK3566[3B], RK3566_FLASH_SD_SARADC[7C]), VCCIO_WL (bidir, see Overview[4B], POWER_EXTENSION[1A], POWER_PMIC[1D], POWER_PMIC[4A], RK3566[3B], RK3566_FLASH_SD_SARADC[7C]), VDD_CPU (bidir, see Overview[5B], POWER_EXTENSION[1A], RK3566[3D], RK3566_POWER[3A])

### Harnesses
VCC_SYS: VCC3V3_SYS, VCC5V0_SYS

### Nets
+12: F2.1 R111.2 R119.2 R120.1 USB4.2(VBUS) USB4.11(VBUS)
GND: C65.1 C66.1 C67.1 C68.1 C69.1 C242.1 C243.1 C244.1 C245.1 C246.1 C247.1 C251.1 LED1.1(K) R42.1 R43.1 R112.1 R113.1 R118.1 U19.2(GND) U22.11(GND) U41.2(GND) USB4.1(GND) USB4.12(GND) USB4.13(SHELL) USB4.14(SHELL)
VCC3V3_PMU: sheet POWER_PMIC/VCC3V3_PMU, sheet POWER_EXTENSION/VCC3V3_PMU, sheet POWER_FLASH_POWER_MANAGE/VCC3V3_PMU
VCC3V3_SYS: C64.2 C65.2 C66.2 L2.2 R39.2 R40.2 ; port VCC_SYS.VCC3V3_SYS
VCC5V0_SYS: C67.2 C68.2 C241.2 C242.2 C243.2 L11.2 R41.1 R109.2 U19.5(OVP) ; port VCC_SYS.VCC5V0_SYS
VCC12V_DCIN: C244.2 C245.2 F2.2 R110.1 U41.5(OVP)
VCC_1V8: sheet POWER_PMIC/VCC_1V8, sheet POWER_FLASH_POWER_MANAGE/VCC_1V8
VCCA_1V8: port VCCA_1V8, sheet POWER_PMIC/VCCA_1V8
VCCIO_ACODEC: port VCCIO_ACODEC, sheet POWER_PMIC/VCCIO_ACODEC
VCCIO_SD: port VCCIO_SD, sheet POWER_PMIC/VCCIO_SD
VCCIO_WL: port VCCIO_WL, sheet POWER_PMIC/VCCIO_WL, sheet POWER_EXTENSION/VCCIO_WL
VDD_CPU: port VDD_CPU, sheet POWER_EXTENSION/VDD_CPU
CC1: U22.7(CC1) USB4.4(CC1)
CC2: U22.6(CC2) USB4.10(CC2)
FLASH_VOL_SEL: port FLASH_VOL_SEL, sheet POWER_FLASH_POWER_MANAGE/FLASH_VOL_SEL
PMIC_32KOUT_WIFI: port PMIC_32KOUT_WIFI, sheet POWER_PMIC/PMIC_32KOUT_WIFI
PMIC_INT_L: port PMIC_INT_L, sheet POWER_PMIC/PMIC_INT_L
PMIC_SLEEP_H: port PMIC_SLEEP_H, sheet POWER_PMIC/PMIC_SLEEP_H, sheet POWER_EXTENSION/PMIC_SLEEP_H
PWRON_KEY: port PWRON_KEY, sheet POWER_PMIC/PWRON_KEY
RESETN: port RESETN, sheet POWER_PMIC/RESETN
NetC63_1: C63.1 U19.1(LX)
NetC63_2: C63.2 L2.1 U19.6(IN)
NetC64_1: C64.1 R39.1 R43.2 U19.3(FB)
NetC69_2: C69.2 R41.2 R42.2 U19.4(EN/PWM)
NetC240_1: C240.1 U41.1(LX)
NetC240_2: C240.2 L11.1 U41.6(IN)
NetC241_1: C241.1 R109.1 R113.2 U41.3(FB)
NetC246_2: C246.2 R110.2 R112.2 U41.4(EN/PWM)
NetC247_2: C247.2 R111.1
NetC251_2: C251.2 R119.1 U22.1(VDD)
NetLED1_2: LED1.2(A) R40.1
NetR118_2: R118.2 U22.9(CFG1)
NetR120_2: R120.2 U22.8(VBUS)
NetU22_4: U22.4(DP) U22.5(DM)

Not connected (* = marked no-connect by the designer): U22 2(CFG2)* 3(CFG3)* 10(PG)*; USB4 3(SBU2)* 5(DN2)* 6(DP1)* 7(DN1)* 8(DP2)* 9(SBU1)*

### Buses and harness runs
harness port AUDIO = sheet POWER_PMIC/AUDIO
harness port HPJ = sheet POWER_PMIC/HPJ
harness port I2C0_PMIC = sheet POWER_EXTENSION/I2C0_PMIC = sheet POWER_PMIC/I2C0_PMIC
harness port I2S1_PMIC = sheet POWER_PMIC/I2S1_PMIC
harness port PMIC_Control = sheet POWER_PMIC/PMIC_Control
harness port PWR_DDR = sheet POWER_FLASH_POWER_MANAGE/PWR_DDR = sheet POWER_PMIC/PWR_DDR
harness port PWR_IMAGE = sheet POWER_PMIC/PWR_IMAGE
harness port PWR_PMU = sheet POWER_PMIC/PWR_PMU
harness port RK809_DCDC = sheet POWER_PMIC/RK809_DCDC
harness port VCC_SYS = sheet POWER_EXTENSION/VCC_SYS = sheet POWER_FLASH_POWER_MANAGE/VCC_SYS = sheet POWER_PMIC/VCC_SYS

### Notes on the sheet
- DCDC
- LDO

### Library data of the parts
C63 C66 C68 C69 C240 C243 C245 C246 = 100nF: as C5-C20 on sheet LPDDR4
C64 C241 = 22pF: 50V 22pF C0G ±5% 0402 Ceramic Capacitors ROHS
C65 = 22uF: as C127 on sheet RK3566_POWER
C67 C242 C244 C251 = 10uF: as C128 on sheet RK3566_POWER
C247 = 2.2uF: as C158 on sheet EMMC_SD
F2 = BSMD0805L-200: 6V 2A 0805自恢复; Symbol: BSMD0805L-200
L2 = MWSA0402S-3R3MT: SMD,4.4x4.2mm 特性：铁合金材料,高饱和电流,低DCR。闭合磁路设计,漏磁干扰小。无卤,符合RoHS标准。Metal material for large current and low DCR。Closed magnetic circuit design reduces leakage flux。Halogen free, RoHS compliant。应用：TV、显卡、内存。笔记本电脑、平板电脑; Manufacturer: Sunltech(顺磁); Symbol: SLW4030S1R0NST; Add into BOM: yes; Value: 1uH; Tolerance: ±30%; Current Rating: 4.15A; DC Resistance(DCR): 18mΩ; Device: SLW4030S1R0NST; LCSC Part Name: 1uH ±30%; Supplier Part: C206354; Manufacturer Part: SLW4030S1R0NST; Supplier Footprint: SMD,4x4mm; JLCPCB Part Class: Extended Part; Datasheet: https://item.szlcsc.com/datasheet/SLW4030S1R0NST/207399.html; Supplier: LCSC; Convert to PCB: yes
L11 = FXL0420-6R8-M: 6.8uH ±20% 2.5A SMD，4.4x4.2x1.8mm   合金电感，一体成型电感，大电流; Manufacturer: Sunltech(顺磁); Symbol: SLW4030S1R0NST; Add into BOM: yes; Value: 1uH; Tolerance: ±30%; Current Rating: 4.15A; DC Resistance(DCR): 18mΩ; Device: SLW4030S1R0NST; LCSC Part Name: 1uH ±30%; Supplier Part: C206354; Manufacturer Part: SLW4030S1R0NST; Supplier Footprint: SMD,4x4mm; JLCPCB Part Class: Extended Part; Datasheet: https://item.szlcsc.com/datasheet/SLW4030S1R0NST/207399.html; Supplier: LCSC; Convert to PCB: yes
LED1 = KT-0603B: 30mA 2.6V~3.2V Blue 0603 LED Indication - Discrete ROHS
R39 R109 = 232kΩ: 62.5mW 232kΩ 50V ±100ppm/℃ Thick Film Resistor ±1% 0402 Chip Resistor - Surface Mount ROHS
R40 = 5.1kΩ: as R13 on sheet Wi-Fi_BT
R41 R110 = 47kΩ: 62.5mW 47kΩ 50V ±100ppm/℃ Thick Film Resistor ±1% 0402 Chip Resistor - Surface Mount ROHS
R42 R112 R113 = 30kΩ: 62.5mW 30K 50V ±100ppm/℃ Thick Film Resistor ±1% 0402 Chip Resistor - Surface Mount ROHS
R43 = 51kΩ: 51kΩ 62.5mW 50V ±100ppm/℃ Thick Film Resistor ±1% 0402 Chip Resistor - Surface Mount ROHS
R111 = 2.2Ω: 小尺寸、重量轻。降低组装成本,与贴片机匹配。适用于波峰焊和回流焊
R118 = 24kΩ: 24kΩ 62.5mW 50V ±100ppm/℃ Thick Film Resistor ±1% 0402 Chip Resistor - Surface Mount ROHS
R119 = 1kΩ: as R15 on sheet HDMI
R120 = 10kΩ: as R64-R66 on sheet EMMC_SD
U19 U41 = SY8113BADC: 高效率500kHz 3A 18V输入同步降压转换器 SY8113B是一款高效率的500kHz同步降压DC-DC转换器,能够提供3A的输出电流。其输入电压范围为4.5V至18V,集成了主开关和同步开关,具有非常低的导通损耗。采用瞬时PWM架构,实现快速瞬态响应。低输出电压纹波和小型外部电感器和电容器尺寸通过500kHz开关频率实现。内部软启动限制了浪涌电流。; Symbol: SY7201ABC
U22 = CH224K: USBPD等多快充协议受电芯片CH224 ESSOP-10-150mil-1mm; Symbol: CH224K
USB4 = TYPE-C 16PIN 2MD(073): 16pin type-c